# EAGLE design PCB0M3_12B (EAGLE 6.2)

## Sheet 1 of 7
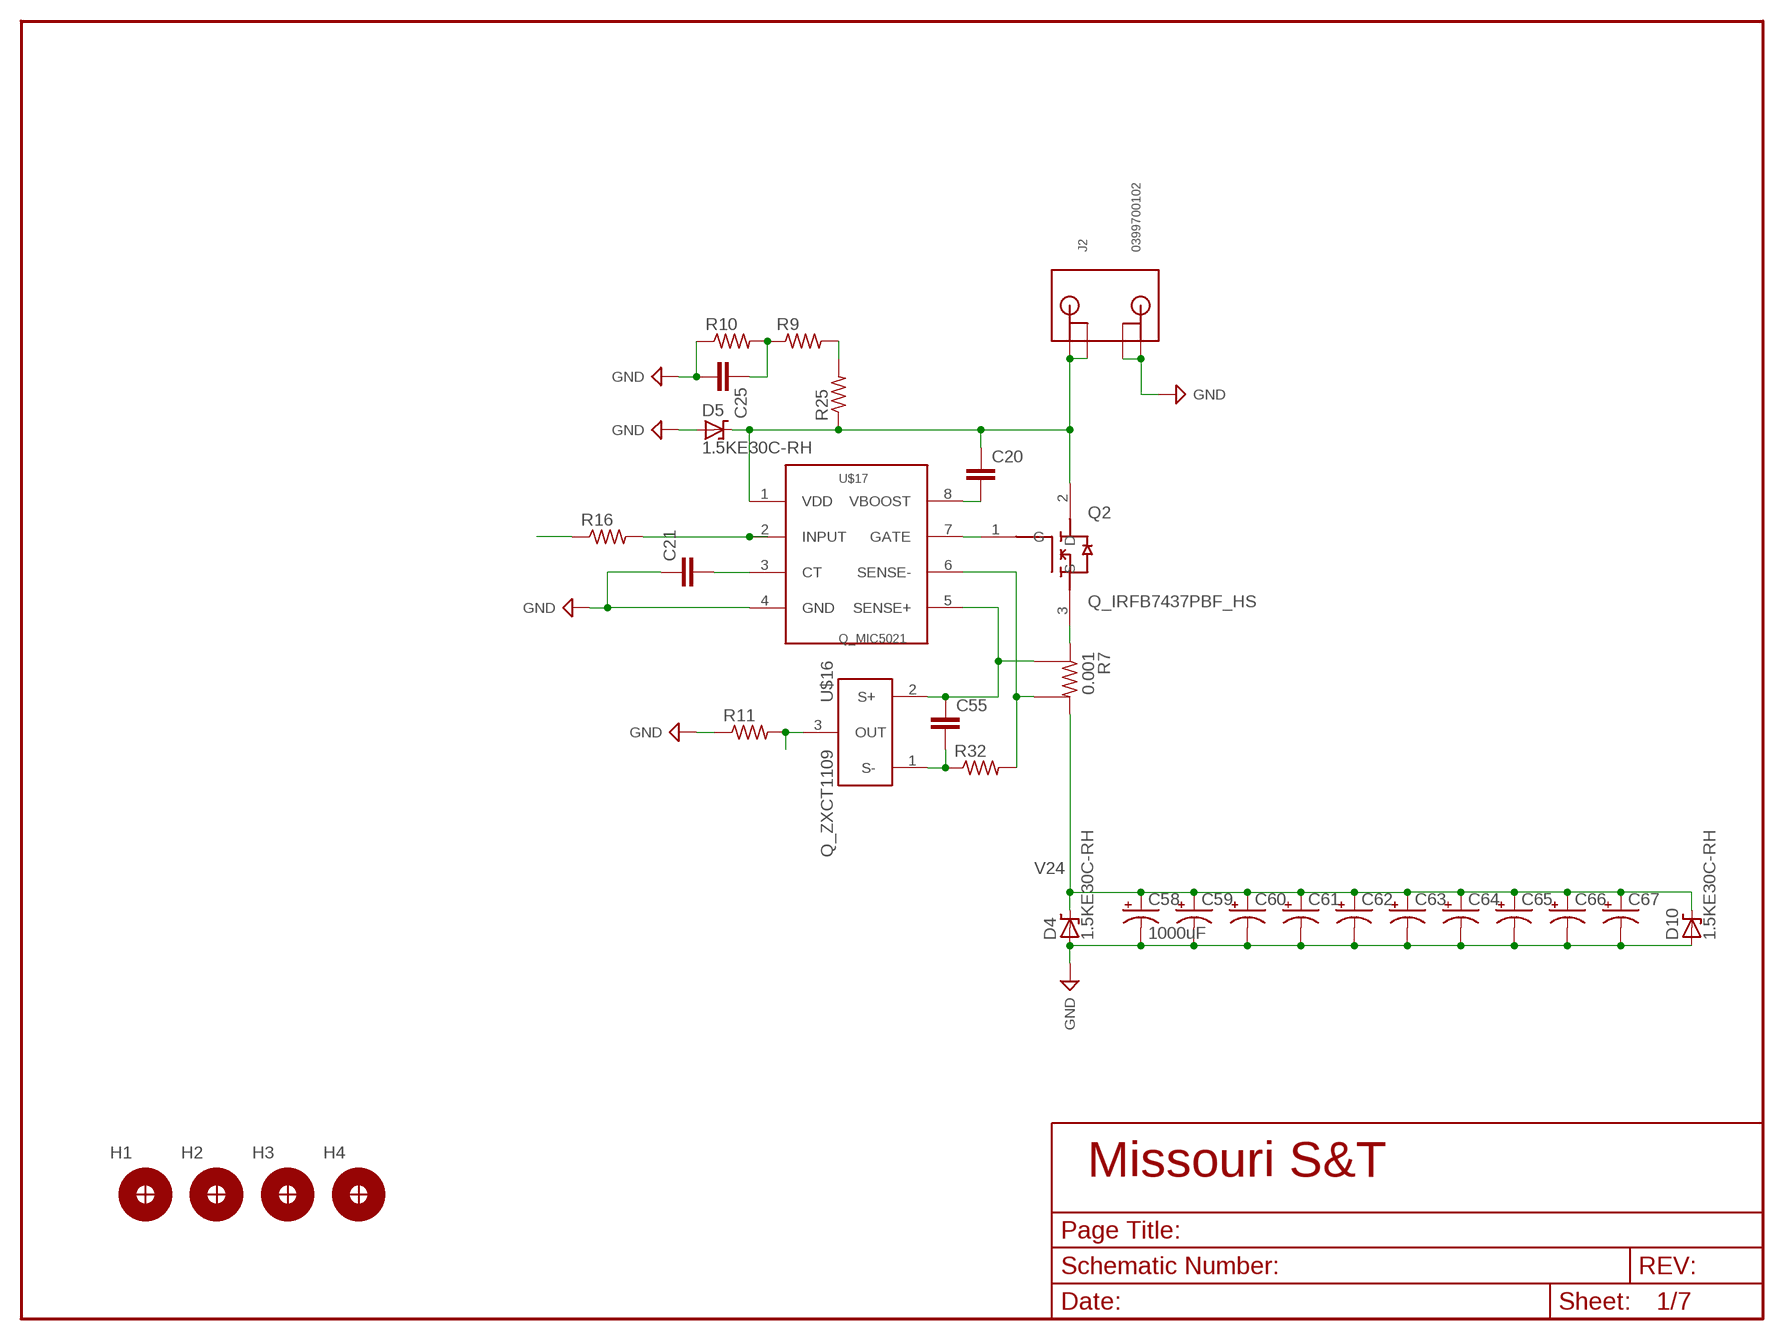
[diagram p0: schematic, sheet 1]

### Parts
C20  C_CAP_1206  [C_1206]
C21  C_CAP_1206  [C_1206]
C25  C_CAP_1206  [C_1206]
C55  C_CAP_1206  [C_1206]
C58  1000uF  C_POL10MM  [C_10MM]
C59  C_POL10MM  [C_10MM]
C60  C_POL10MM  [C_10MM]
C61  C_POL10MM  [C_10MM]
C62  C_POL10MM  [C_10MM]
C63  C_POL10MM  [C_10MM]
C64  C_POL10MM  [C_10MM]
C65  C_POL10MM  [C_10MM]
C66  C_POL10MM  [C_10MM]
C67  C_POL10MM  [C_10MM]
D4  1.5KE30C-RH  D_1.5KE480A_D3.5MM_LS15.24MM  [DIODE_D3.5MM_LS15.24MM]
D5  1.5KE30C-RH  D_1.5KE480A_D3.5MM_LS15.24MM  [DIODE_D3.5MM_LS15.24MM]
D10  1.5KE30C-RH  D_1.5KE480A_D3.5MM_LS15.24MM  [DIODE_D3.5MM_LS15.24MM]
H1  H_MNTHOLE_#8  [H_MNTHOLE_#8]
H2  H_MNTHOLE_#8  [H_MNTHOLE_#8]
H3  H_MNTHOLE_#8  [H_MNTHOLE_#8]
H4  H_MNTHOLE_#8  [H_MNTHOLE_#8]
J2  0399700102  J_0399700102  [J_2CONHC]
Q2  Q_IRFB7437PBF_HS  [TO-220-531102B02500G]
R7  0.001  R_FC4L110R001JER  [R_FC4L]
R9  R_RES_1206  [R_1206]
R10  R_RES_1206  [R_1206]
R11  R_RES_1206  [R_1206]
R16  R_RES_1206  [R_1206]
R25  R_1/4W  [R_1/4W]
R32  R_RES_1206  [R_1206]
U$16  Q_ZXCT1109  [SOT23]
U$17  Q_MIC5021  [DIP8]

### Nets
GND: C21.1 C25.2 C58.P$2(-) C59.P$2(-) C60.P$2(-) C61.P$2(-) C62.P$2(-) C63.P$2(-) C64.P$2(-) C65.P$2(-) C66.P$2(-) C67.P$2(-) D4.A D5.A D10.A J2.PIN2-1(2-1) J2.PIN2-2(2-2) R10.1 R11.1 U$17.4(GND) ; supply symbol labelled SUP_GND ; also sheet 2,3,4,5,6,7
M_IMAIN: R11.2 U$16.3(OUT) ; also sheet 7
M_VMAIN: C25.1 R9.1 R10.2 ; also sheet 7
N$44: Q2.1(G) U$17.7(GATE)
N$45: Q2.3(S) R7.1
N$46: C55.1 R7.SENSE1 U$16.2(S+) U$17.5(SENSE+)
N$47: R16.2 U$17.2(INPUT)
N$48: C21.2 U$17.3(CT)
N$51: C55.2 R32.1 U$16.1(S-)
N$85: R7.SENSE2 R32.2 U$17.6(SENSE-)
N$92: R9.2 R25.2
N$95: C20.2 U$17.8(VBOOST)
S_MAIN: R16.1 ; also sheet 7
V1: C20.1 D5.C(K) J2.PIN1-1(1-1) J2.PIN1-2(1-2) Q2.2(D) R25.1 U$17.1(VDD) ; also sheet 7
V24: C58.P$1(+) C59.P$1(+) C60.P$1(+) C61.P$1(+) C62.P$1(+) C63.P$1(+) C64.P$1(+) C65.P$1(+) C66.P$1(+) C67.P$1(+) D4.C(K) D10.C(K) R7.2 ; also sheet 2,3,5,6
Unconnected: H1.1 H2.1 H3.1 H4.1

## Sheet 2 of 7
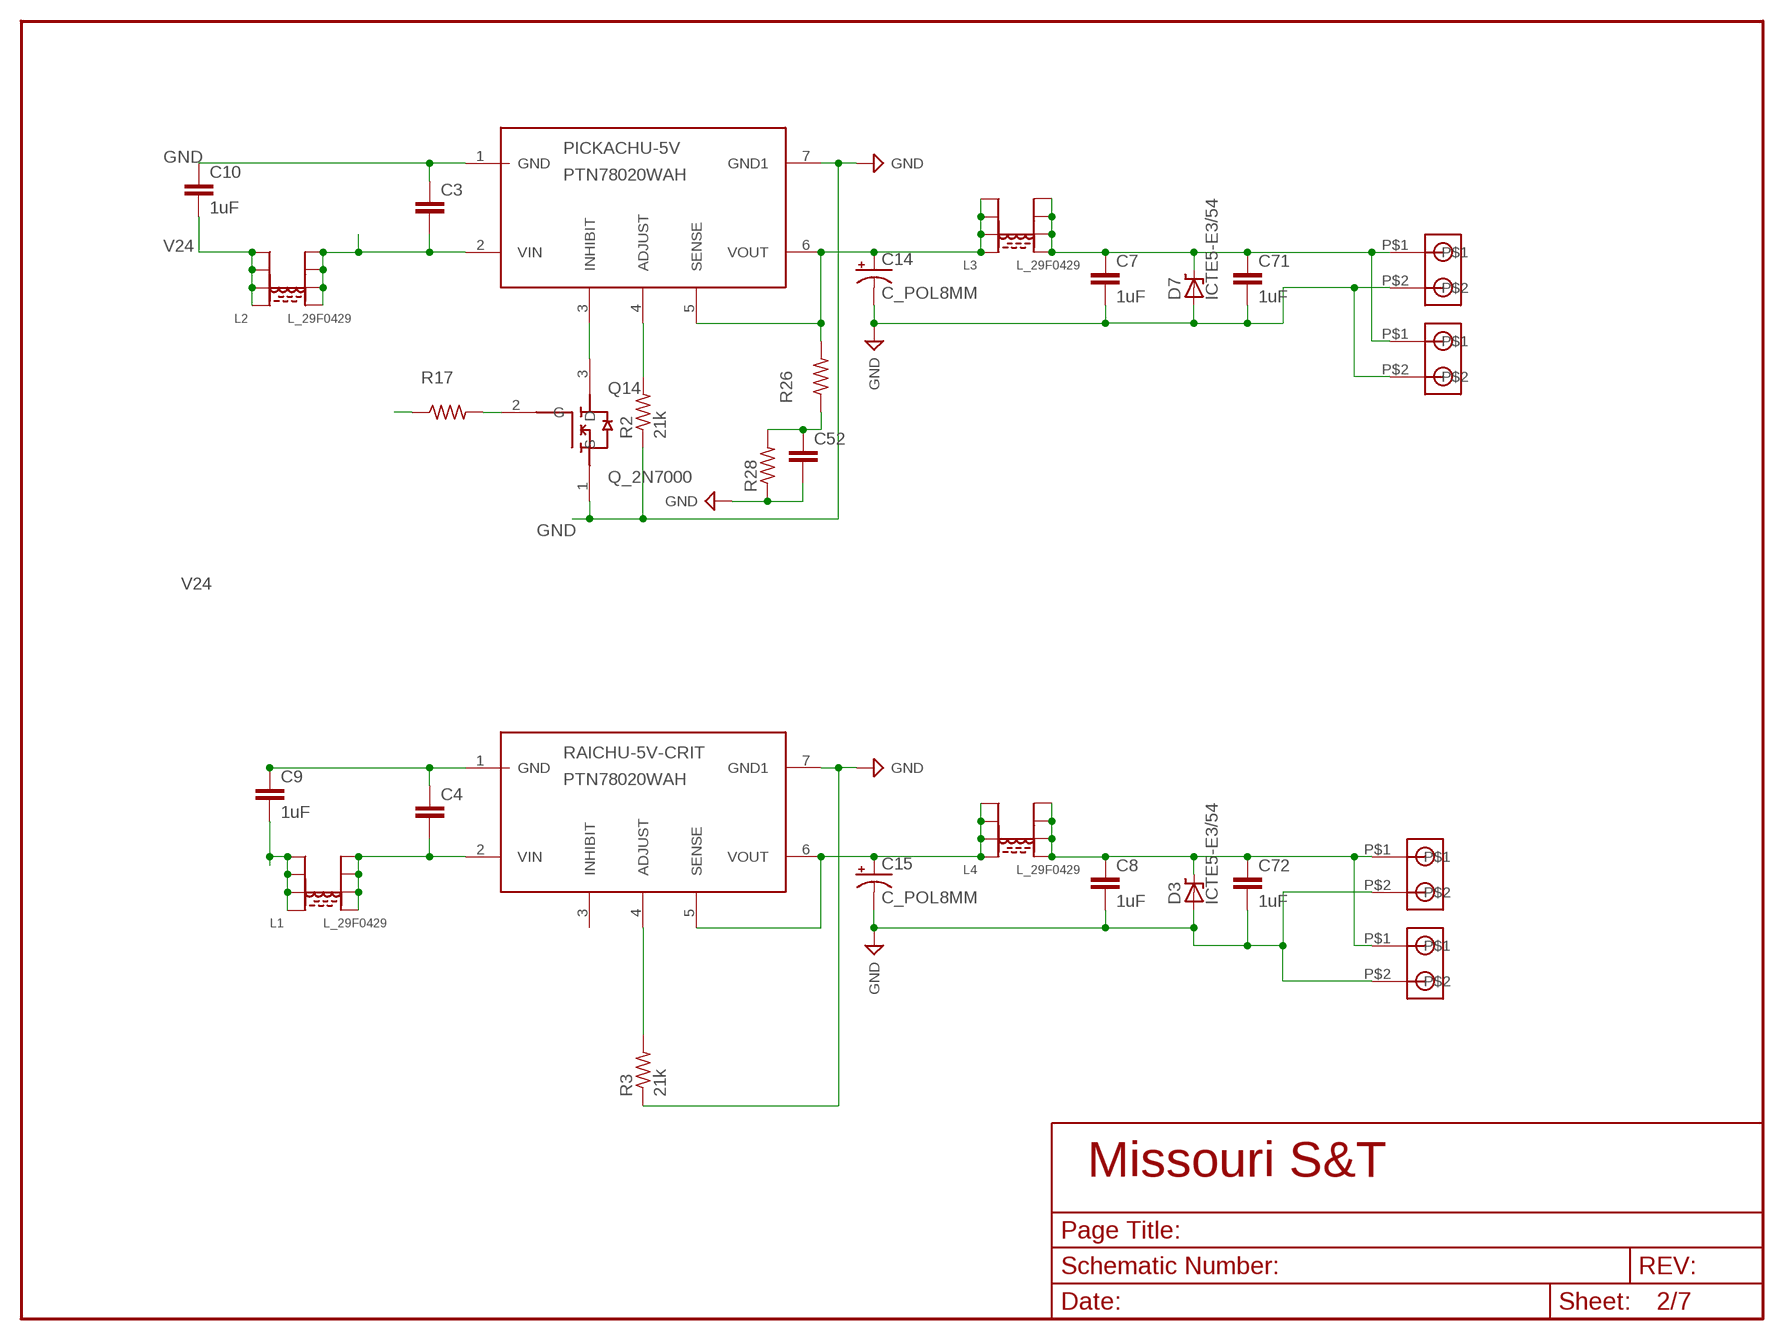
[diagram p1: schematic, sheet 2]

### Parts
C3  C_CAP_1206  [C_1206]
C4  C_CAP_1206  [C_1206]
C7  1uF  C_CAP_1206  [C_1206]
C8  1uF  C_CAP_1206  [C_1206]
C9  1uF  C_CAP_1206  [C_1206]
C10  1uF  C_CAP_1206  [C_1206]
C14  C_POL8MM  [C_8MM]
C15  C_POL8MM  [C_8MM]
C52  C_CAP_1206  [C_1206]
C71  1uF  C_CAP_1206  [C_1206]
C72  1uF  C_CAP_1206  [C_1206]
D3  ICTE5-E3/54  D_1.5KE480A_D3.5MM_LS15.24MM  [DIODE_D3.5MM_LS15.24MM]
D7  ICTE5-E3/54  D_1.5KE480A_D3.5MM_LS15.24MM  [DIODE_D3.5MM_LS15.24MM]
L1  L_29F0429  [L_29F0429]
L2  L_29F0429  [L_29F0429]
L3  L_29F0429  [L_29F0429]
L4  L_29F0429  [L_29F0429]
PICKACHU-5V  PTN78020WAH  Q_PTN78020  [R_PDSS-T7]
Q14  Q_2N7000  [TO-92-3]
R2  21k  R_1/4W  [R_1/4W]
R3  21k  R_1/4W  [R_1/4W]
R17  R_1/4WL  [R_1/4WL]
R26  R_1/4WL  [R_1/4WL]
R28  R_RES_1206  [R_1206]
RAICHU-5V-CRIT  PTN78020WAH  Q_PTN78020  [R_PDSS-T7]
U$52  J_1546074-2282834-2  [J_2.54MM]
U$53  J_1546074-2282834-2  [J_2.54MM]
U$54  J_1546074-2282834-2  [J_2.54MM]
U$55  J_1546074-2282834-2  [J_2.54MM]

### Nets
GND: C3.1 C4.1 C7.2 C8.2 C9.1 C10.1 C14.- C15.- C52.2 C71.2 C72.2 D3.A D7.A PICKACHU-5V.1(GND) PICKACHU-5V.7(GND1) Q14.1(S) R2.1 R3.1 R28.1 RAICHU-5V-CRIT.1(GND) RAICHU-5V-CRIT.7(GND1) U$52.P$2 U$53.P$2 U$54.P$2 U$55.P$2 ; supply symbol labelled SUP_GND ; also sheet 1,3,4,5,6,7
M_V5-2: C52.1 R26.1 R28.2 ; also sheet 7
N$3: Q14.2(G) R17.2
N$49: R3.2 RAICHU-5V-CRIT.4(ADJUST)
N$50: PICKACHU-5V.4(ADJUST) R2.2
N$53: C14.+ L3.1 L3.2 L3.3 L3.4 PICKACHU-5V.5(SENSE) PICKACHU-5V.6(VOUT) R26.2
N$54: C15.+ L4.1 L4.2 L4.3 L4.4 RAICHU-5V-CRIT.5(SENSE) RAICHU-5V-CRIT.6(VOUT)
N$65: C3.2 L2.5 L2.6 L2.7 L2.8 PICKACHU-5V.2(VIN)
N$103: PICKACHU-5V.3(INHIBIT) Q14.3(D)
N$112: C4.2 L1.5 L1.6 L1.7 L1.8 RAICHU-5V-CRIT.2(VIN)
S_V5-2: R17.1 ; also sheet 7
V5-CRT: C8.1 C72.1 D3.C(K) L4.5 L4.6 L4.7 L4.8 U$52.P$1 U$53.P$1
V12: C7.1 C71.1 D7.C(K) L3.5 L3.6 L3.7 L3.8 U$54.P$1 U$55.P$1
V24: C9.2 C10.2 L1.1 L1.2 L1.3 L1.4 L2.1 L2.2 L2.3 L2.4 ; also sheet 1,3,5,6
Unconnected: RAICHU-5V-CRIT.3(INHIBIT)

## Sheet 3 of 7
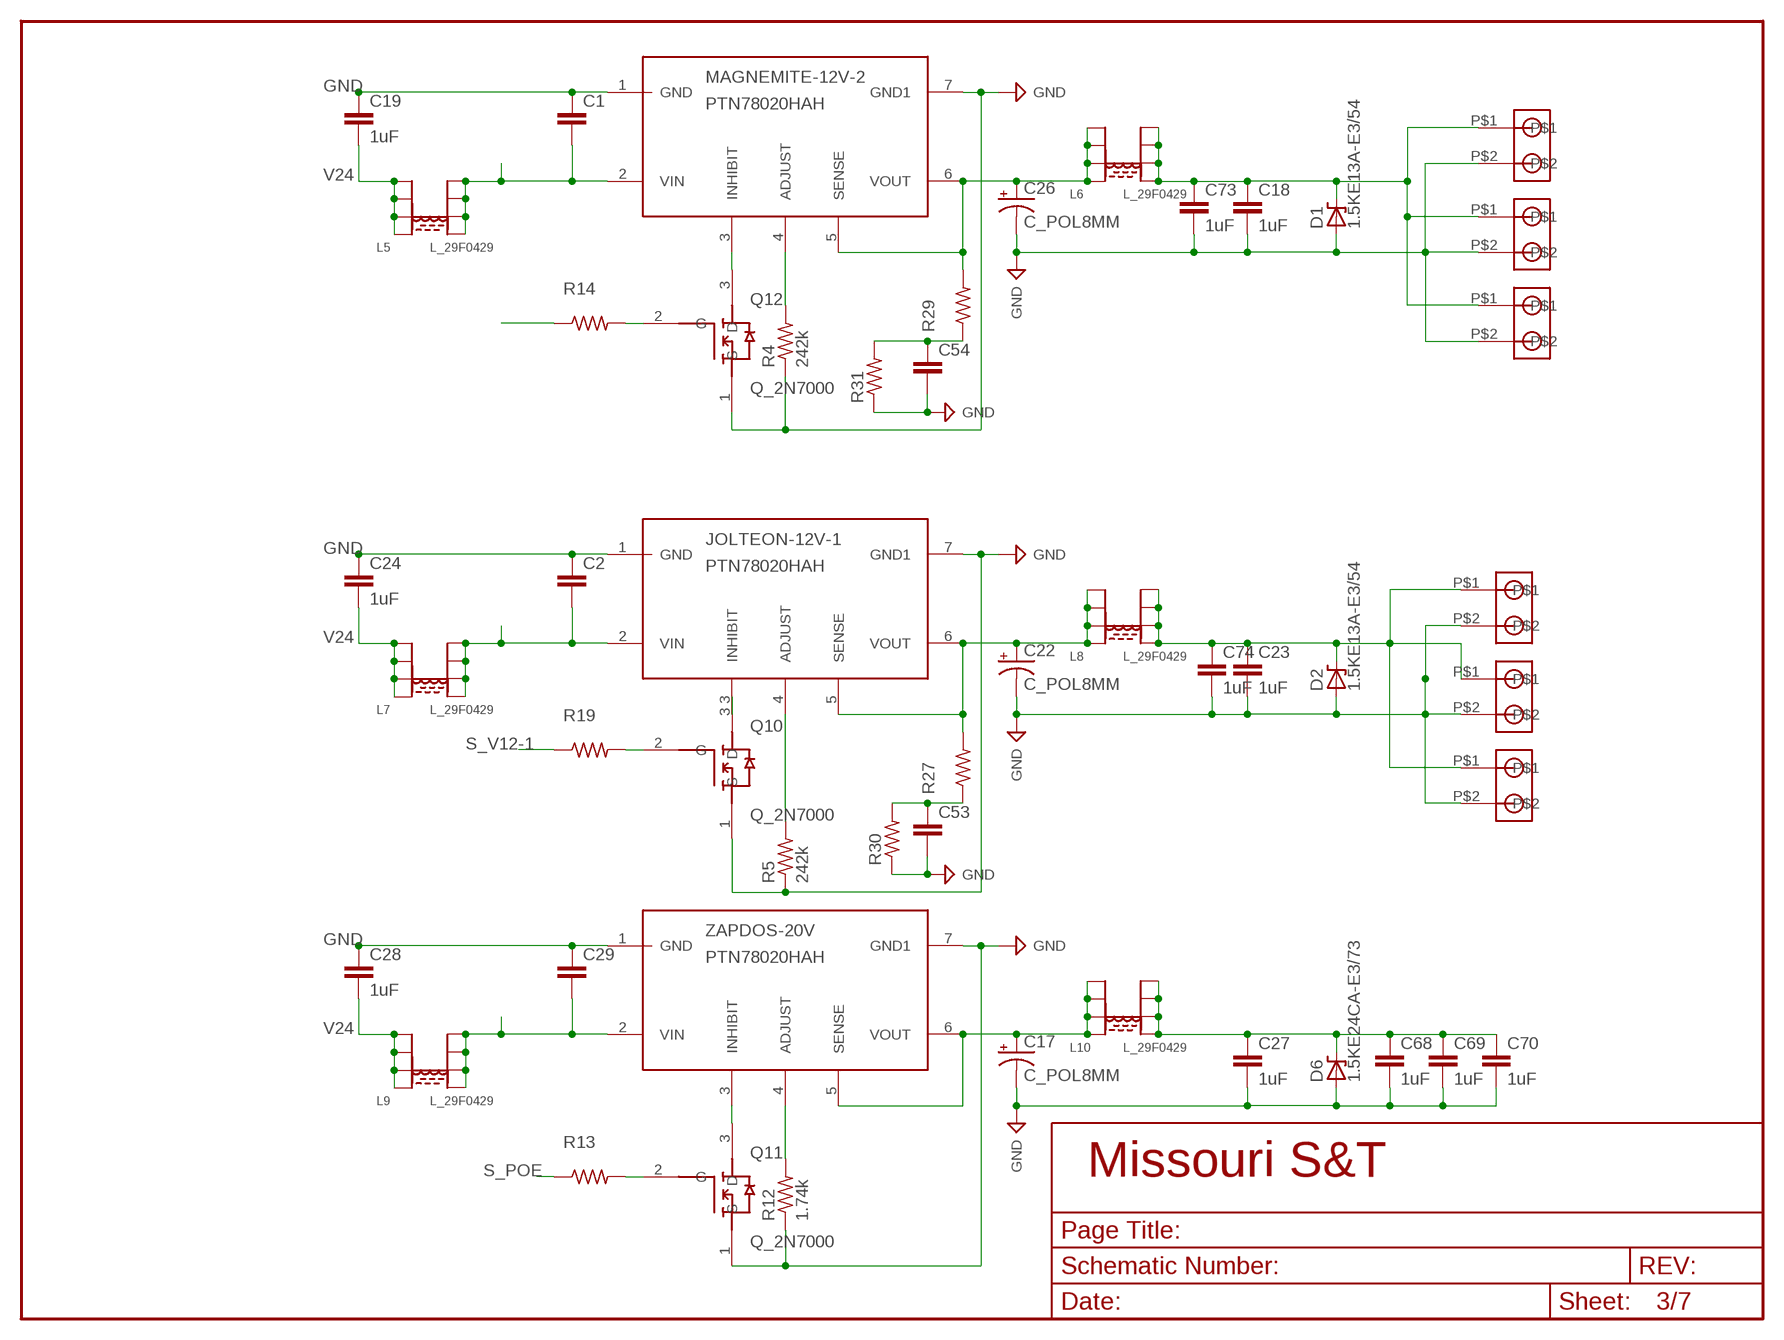
[diagram p2: schematic, sheet 3]

### Parts
C1  C_CAP_1206  [C_1206]
C2  C_CAP_1206  [C_1206]
C17  C_POL8MM  [C_8MM]
C18  1uF  C_CAP_1206  [C_1206]
C19  1uF  C_CAP_1206  [C_1206]
C22  C_POL8MM  [C_8MM]
C23  1uF  C_CAP_1206  [C_1206]
C24  1uF  C_CAP_1206  [C_1206]
C26  C_POL8MM  [C_8MM]
C27  1uF  C_CAP_1206  [C_1206]
C28  1uF  C_CAP_1206  [C_1206]
C29  C_CAP_1206  [C_1206]
C53  C_CAP_1206  [C_1206]
C54  C_CAP_1206  [C_1206]
C68  1uF  C_CAP_1206  [C_1206]
C69  1uF  C_CAP_1206  [C_1206]
C70  1uF  C_CAP_1206  [C_1206]
C73  1uF  C_CAP_1206  [C_1206]
C74  1uF  C_CAP_1206  [C_1206]
D1  1.5KE13A-E3/54  D_1.5KE480A_D3.5MM_LS15.24MM  [DIODE_D3.5MM_LS15.24MM]
D2  1.5KE13A-E3/54  D_1.5KE480A_D3.5MM_LS15.24MM  [DIODE_D3.5MM_LS15.24MM]
D6  1.5KE24CA-E3/73  D_1.5KE480A_D3.5MM_LS15.24MM  [DIODE_D3.5MM_LS15.24MM]
J3  J_1546074-2282834-2  [J_2.54MM]
J4  J_1546074-2282834-2  [J_2.54MM]
J5  J_1546074-2282834-2  [J_2.54MM]
J6  J_1546074-2282834-2  [J_2.54MM]
J7  J_1546074-2282834-2  [J_2.54MM]
J8  J_1546074-2282834-2  [J_2.54MM]
JOLTEON-12V-1  PTN78020HAH  Q_PTN78020  [R_PDSS-T7]
L5  L_29F0429  [L_29F0429]
L6  L_29F0429  [L_29F0429]
L7  L_29F0429  [L_29F0429]
L8  L_29F0429  [L_29F0429]
L9  L_29F0429  [L_29F0429]
L10  L_29F0429  [L_29F0429]
MAGNEMITE-12V-2  PTN78020HAH  Q_PTN78020  [R_PDSS-T7]
Q10  Q_2N7000  [TO-92-3]
Q11  Q_2N7000  [TO-92-3]
Q12  Q_2N7000  [TO-92-3]
R4  242k  R_1/4W  [R_1/4W]
R5  242k  R_1/4W  [R_1/4W]
R12  1.74k  R_1/4W  [R_1/4W]
R13  R_1/4WL  [R_1/4WL]
R14  R_1/4WL  [R_1/4WL]
R19  R_1/4WL  [R_1/4WL]
R27  R_1/4WL  [R_1/4WL]
R29  R_1/4WL  [R_1/4WL]
R30  R_RES_1206  [R_1206]
R31  R_RES_1206  [R_1206]
ZAPDOS-20V  PTN78020HAH  Q_PTN78020  [R_PDSS-T7]

### Nets
GND: C1.1 C2.1 C17.- C18.2 C19.1 C22.- C23.2 C24.1 C26.- C27.2 C28.1 C29.1 C53.2 C54.2 C68.2 C69.2 C70.2 C73.2 C74.2 D1.A D2.A D6.A J3.P$2 J4.P$2 J5.P$2 J6.P$2 J7.P$2 J8.P$2 JOLTEON-12V-1.1(GND) JOLTEON-12V-1.7(GND1) MAGNEMITE-12V-2.1(GND) MAGNEMITE-12V-2.7(GND1) Q10.1(S) Q11.1(S) Q12.1(S) R4.1 R5.1 R12.1 R30.1 R31.1 ZAPDOS-20V.1(GND) ZAPDOS-20V.7(GND1) ; supply symbol labelled SUP_GND ; also sheet 1,2,4,5,6,7
M_V12-1: C53.1 R27.1 R30.2 ; also sheet 7
M_V12-2: C54.1 R29.1 R31.2 ; also sheet 7
N$1: MAGNEMITE-12V-2.4(ADJUST) R4.2
N$2: C26.+ L6.1 L6.2 L6.3 L6.4 MAGNEMITE-12V-2.5(SENSE) MAGNEMITE-12V-2.6(VOUT) R29.2
N$4: JOLTEON-12V-1.4(ADJUST) R5.2
N$5: C22.+ JOLTEON-12V-1.5(SENSE) JOLTEON-12V-1.6(VOUT) L8.1 L8.2 L8.3 L8.4 R27.2
N$57: C1.2 L5.5 L5.6 L5.7 L5.8 MAGNEMITE-12V-2.2(VIN)
N$88: R12.2 ZAPDOS-20V.4(ADJUST)
N$97: C17.+ L10.1 L10.2 L10.3 L10.4 ZAPDOS-20V.5(SENSE) ZAPDOS-20V.6(VOUT)
N$98: C29.2 L9.5 L9.6 L9.7 L9.8 ZAPDOS-20V.2(VIN)
N$99: JOLTEON-12V-1.3(INHIBIT) Q10.3(D)
N$100: MAGNEMITE-12V-2.3(INHIBIT) Q12.3(D)
N$101: Q11.3(D) ZAPDOS-20V.3(INHIBIT)
N$110: C2.2 JOLTEON-12V-1.2(VIN) L7.5 L7.6 L7.7 L7.8
N$111: Q11.2(G) R13.2
N$113: Q10.2(G) R19.2
N$114: Q12.2(G) R14.2
S_12V-2: R14.1 ; also sheet 7
S_POE: R13.1 ; also sheet 7
S_V12-1: R19.1 ; also sheet 7
V15_1: C18.1 C73.1 D1.C(K) J6.P$1 J7.P$1 J8.P$1 L6.5 L6.6 L6.7 L6.8
V15_2: C23.1 C74.1 D2.C(K) J3.P$1 J4.P$1 J5.P$1 L8.5 L8.6 L8.7 L8.8
V24: C19.2 C24.2 C28.2 L5.1 L5.2 L5.3 L5.4 L7.1 L7.2 L7.3 L7.4 L9.1 L9.2 L9.3 L9.4 ; also sheet 1,2,5,6
V_POE: C27.1 C68.1 C69.1 C70.1 D6.C(K) L10.5 L10.6 L10.7 L10.8 ; also sheet 4

## Sheet 4 of 7
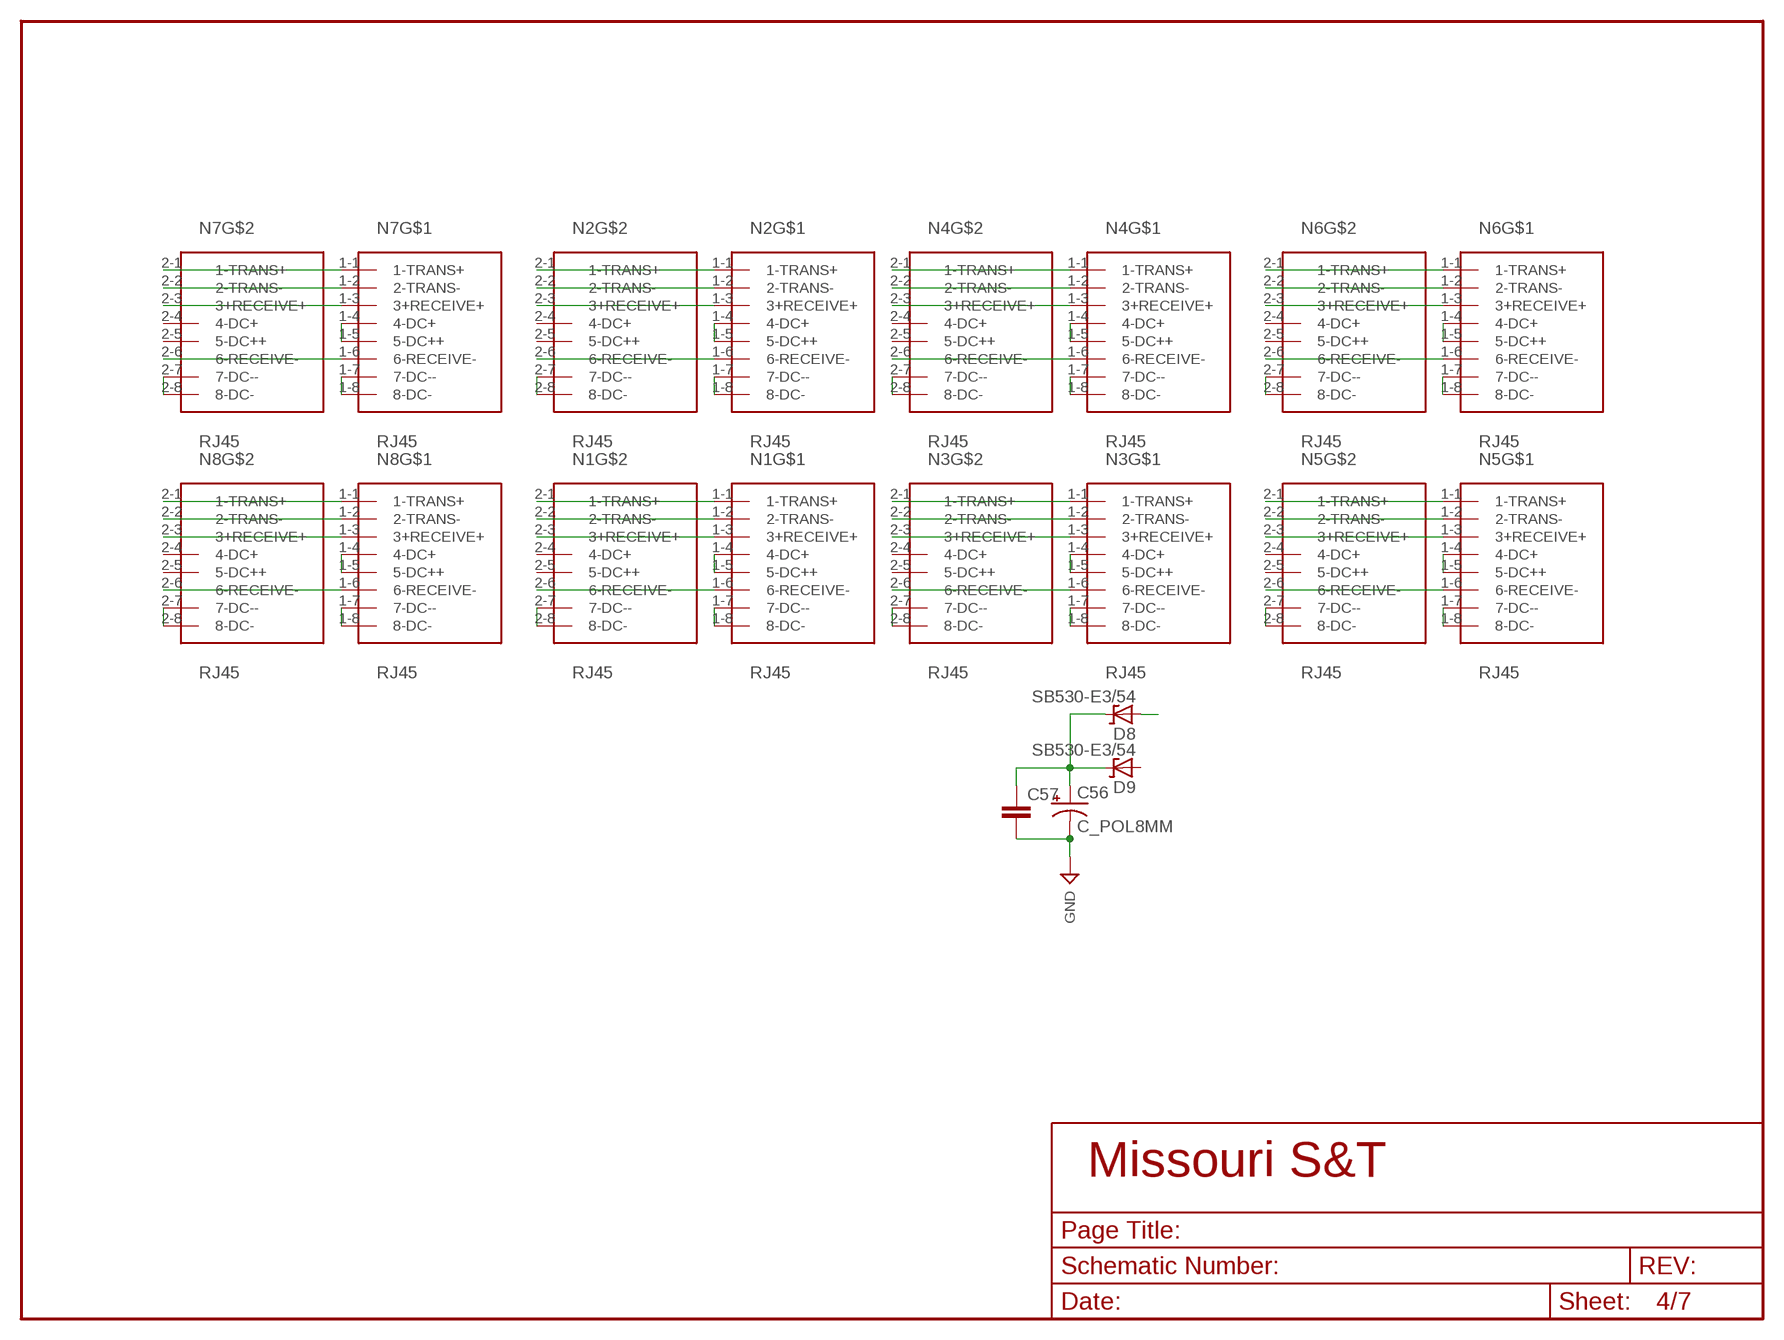
[diagram p3: schematic, sheet 4]

### Parts
C56  C_POL8MM  [C_8MM]
C57  C_CAP_1206  [C_1206]
D8  SB530-E3/54  D_1.5KE480A_D3.5MM_LS15.24MM  [DIODE_D3.5MM_LS15.24MM]
D9  SB530-E3/54  D_1.5KE480A_D3.5MM_LS15.24MM  [DIODE_D3.5MM_LS15.24MM]
N1  RJ45  RJ45-2PORT  [RJ45-CAT5E-2PACK]
N2  RJ45  RJ45-2PORT  [RJ45-CAT5E-2PACK]
N3  RJ45  RJ45-2PORT  [RJ45-CAT5E-2PACK]
N4  RJ45  RJ45-2PORT  [RJ45-CAT5E-2PACK]
N5  RJ45  RJ45-2PORT  [RJ45-CAT5E-2PACK]
N6  RJ45  RJ45-2PORT  [RJ45-CAT5E-2PACK]
N7  RJ45  RJ45-2PORT  [RJ45-CAT5E-2PACK]
N8  RJ45  RJ45-2PORT  [RJ45-CAT5E-2PACK]

### Nets
GND: C56.- C57.2 N1.1-7(7-DC--) N1.1-8(8-DC-) N1.2-7(7-DC--) N1.2-8(8-DC-) N2.1-7(7-DC--) N2.1-8(8-DC-) N2.2-7(7-DC--) N2.2-8(8-DC-) N3.1-7(7-DC--) N3.1-8(8-DC-) N3.2-7(7-DC--) N3.2-8(8-DC-) N4.1-7(7-DC--) N4.1-8(8-DC-) N4.2-7(7-DC--) N4.2-8(8-DC-) N5.1-7(7-DC--) N5.1-8(8-DC-) N5.2-7(7-DC--) N5.2-8(8-DC-) N6.1-7(7-DC--) N6.1-8(8-DC-) N6.2-7(7-DC--) N6.2-8(8-DC-) N7.1-7(7-DC--) N7.1-8(8-DC-) N7.2-7(7-DC--) N7.2-8(8-DC-) N8.1-7(7-DC--) N8.1-8(8-DC-) N8.2-7(7-DC--) N8.2-8(8-DC-) ; supply symbol labelled SUP_GND ; also sheet 1,2,3,5,6,7
N$7: N6.1-1(1-TRANS+) N6.2-1(1-TRANS+)
N$8: N6.1-2(2-TRANS-) N6.2-2(2-TRANS-)
N$9: N6.1-3(3+RECEIVE+) N6.2-3(3+RECEIVE+)
N$10: N6.1-6(6-RECEIVE-) N6.2-6(6-RECEIVE-)
N$11: N5.1-1(1-TRANS+) N5.2-1(1-TRANS+)
N$12: N5.1-2(2-TRANS-) N5.2-2(2-TRANS-)
N$13: N5.1-3(3+RECEIVE+) N5.2-3(3+RECEIVE+)
N$14: N5.1-6(6-RECEIVE-) N5.2-6(6-RECEIVE-)
N$15: N4.1-1(1-TRANS+) N4.2-1(1-TRANS+)
N$16: N4.1-2(2-TRANS-) N4.2-2(2-TRANS-)
N$17: N4.1-3(3+RECEIVE+) N4.2-3(3+RECEIVE+)
N$18: N4.1-6(6-RECEIVE-) N4.2-6(6-RECEIVE-)
N$19: N3.1-1(1-TRANS+) N3.2-1(1-TRANS+)
N$20: N3.1-2(2-TRANS-) N3.2-2(2-TRANS-)
N$21: N3.1-6(6-RECEIVE-) N3.2-6(6-RECEIVE-)
N$22: N2.1-1(1-TRANS+) N2.2-1(1-TRANS+)
N$23: N2.1-2(2-TRANS-) N2.2-2(2-TRANS-)
N$24: N2.1-3(3+RECEIVE+) N2.2-3(3+RECEIVE+)
N$25: N2.1-6(6-RECEIVE-) N2.2-6(6-RECEIVE-)
N$26: N1.1-1(1-TRANS+) N1.2-1(1-TRANS+)
N$27: N1.1-2(2-TRANS-) N1.2-2(2-TRANS-)
N$28: N1.1-3(3+RECEIVE+) N1.2-3(3+RECEIVE+)
N$29: N1.1-6(6-RECEIVE-) N1.2-6(6-RECEIVE-)
N$30: N3.1-3(3+RECEIVE+) N3.2-3(3+RECEIVE+)
N$31: N7.1-1(1-TRANS+) N7.2-1(1-TRANS+)
N$32: N7.1-2(2-TRANS-) N7.2-2(2-TRANS-)
N$33: N7.1-3(3+RECEIVE+) N7.2-3(3+RECEIVE+)
N$34: N7.1-6(6-RECEIVE-) N7.2-6(6-RECEIVE-)
N$35: N8.1-1(1-TRANS+) N8.2-1(1-TRANS+)
N$36: N8.1-2(2-TRANS-) N8.2-2(2-TRANS-)
N$37: N8.1-3(3+RECEIVE+) N8.2-3(3+RECEIVE+)
N$38: N8.1-6(6-RECEIVE-) N8.2-6(6-RECEIVE-)
V_ANTENNA: C56.+ C57.1 D8.C(K) D9.C(K) N1.1-4(4-DC+) N1.1-5(5-DC++)
V_POE: D8.A N2.1-4(4-DC+) N2.1-5(5-DC++) N3.1-4(4-DC+) N3.1-5(5-DC++) N4.1-4(4-DC+) N4.1-5(5-DC++) N5.1-4(4-DC+) N5.1-5(5-DC++) N6.1-4(4-DC+) N6.1-5(5-DC++) N7.1-4(4-DC+) N7.1-5(5-DC++) N8.1-4(4-DC+) N8.1-5(5-DC++) ; also sheet 3
Unconnected: D9.A N1.2-4(4-DC+) N1.2-5(5-DC++) N2.2-4(4-DC+) N2.2-5(5-DC++) N3.2-4(4-DC+) N3.2-5(5-DC++) N4.2-4(4-DC+) N4.2-5(5-DC++) N5.2-4(4-DC+) N5.2-5(5-DC++) N6.2-4(4-DC+) N6.2-5(5-DC++) N7.2-4(4-DC+) N7.2-5(5-DC++) N8.2-4(4-DC+) N8.2-5(5-DC++)

## Sheet 5 of 7
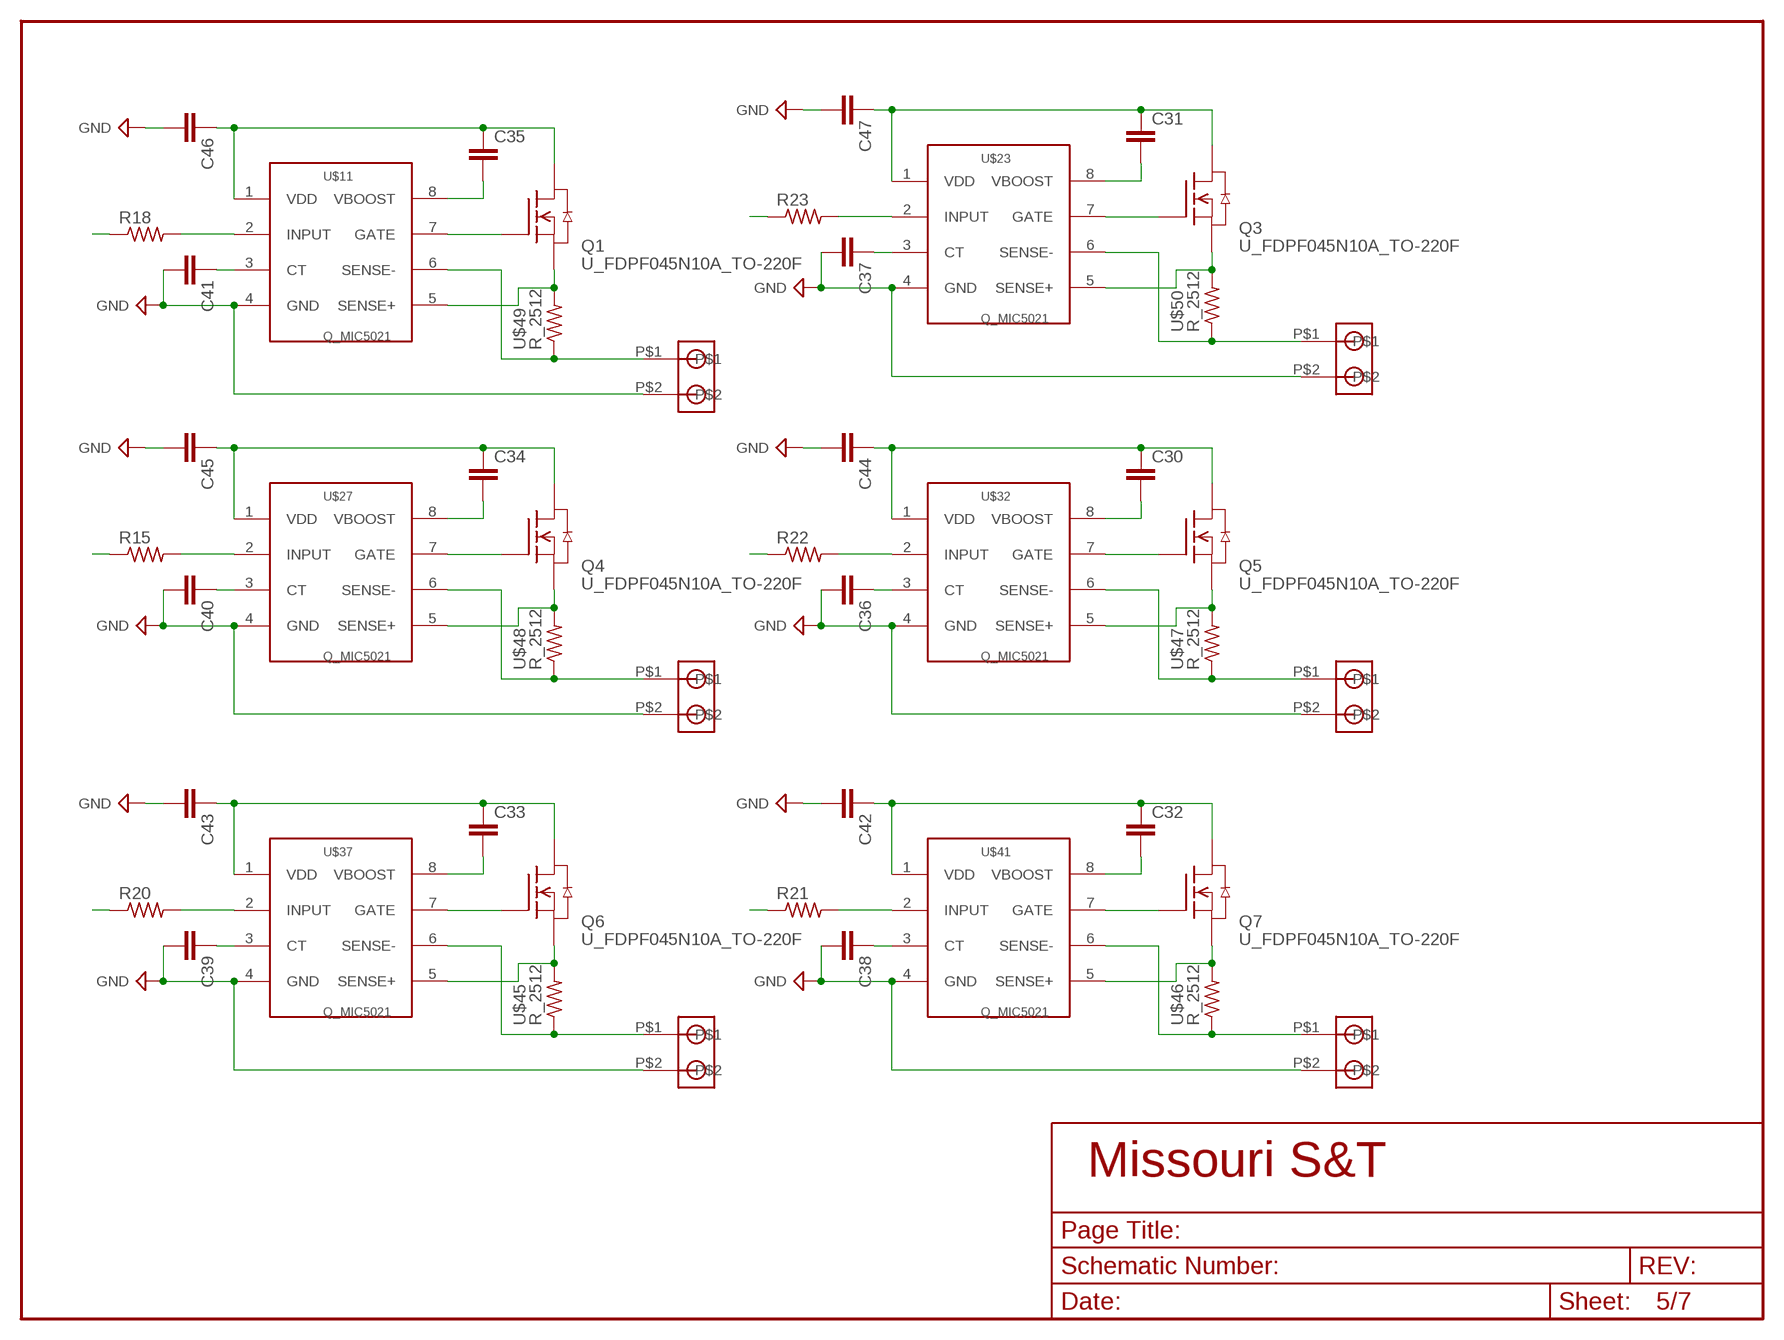
[diagram p4: schematic, sheet 5]

### Parts
C30  C_CAP_1206  [C_1206]
C31  C_CAP_1206  [C_1206]
C32  C_CAP_1206  [C_1206]
C33  C_CAP_1206  [C_1206]
C34  C_CAP_1206  [C_1206]
C35  C_CAP_1206  [C_1206]
C36  C_CAP_1206  [C_1206]
C37  C_CAP_1206  [C_1206]
C38  C_CAP_1206  [C_1206]
C39  C_CAP_1206  [C_1206]
C40  C_CAP_1206  [C_1206]
C41  C_CAP_1206  [C_1206]
C42  C_CAP_1206  [C_1206]
C43  C_CAP_1206  [C_1206]
C44  C_CAP_1206  [C_1206]
C45  C_CAP_1206  [C_1206]
C46  C_CAP_1206  [C_1206]
C47  C_CAP_1206  [C_1206]
Q1  U_FDPF045N10A_TO-220F  [TO220F]
Q3  U_FDPF045N10A_TO-220F  [TO220F]
Q4  U_FDPF045N10A_TO-220F  [TO220F]
Q5  U_FDPF045N10A_TO-220F  [TO220F]
Q6  U_FDPF045N10A_TO-220F  [TO220F]
Q7  U_FDPF045N10A_TO-220F  [TO220F]
R15  R_RES_1206  [R_1206]
R18  R_RES_1206  [R_1206]
R20  R_RES_1206  [R_1206]
R21  R_RES_1206  [R_1206]
R22  R_RES_1206  [R_1206]
R23  R_RES_1206  [R_1206]
U$11  Q_MIC5021  [DIP8]
U$14  J_1546074-2  [THERM_BLOCK_2]
U$23  Q_MIC5021  [DIP8]
U$26  J_1546074-2  [THERM_BLOCK_2]
U$27  Q_MIC5021  [DIP8]
U$31  J_1546074-2  [THERM_BLOCK_2]
U$32  Q_MIC5021  [DIP8]
U$36  J_1546074-2  [THERM_BLOCK_2]
U$37  Q_MIC5021  [DIP8]
U$40  J_1546074-2  [THERM_BLOCK_2]
U$41  Q_MIC5021  [DIP8]
U$44  J_1546074-2  [THERM_BLOCK_2]
U$45  R_2512  [R_2512]
U$46  R_2512  [R_2512]
U$47  R_2512  [R_2512]
U$48  R_2512  [R_2512]
U$49  R_2512  [R_2512]
U$50  R_2512  [R_2512]

### Nets
GND: C36.2 C37.2 C38.2 C39.2 C40.2 C41.2 C42.2 C43.2 C44.2 C45.2 C46.2 C47.2 U$11.4(GND) U$14.P$2 U$23.4(GND) U$26.P$2 U$27.4(GND) U$31.P$2 U$32.4(GND) U$36.P$2 U$37.4(GND) U$40.P$2 U$41.4(GND) U$44.P$2 ; supply symbol labelled SUP_GND ; also sheet 1,2,3,4,6,7
N$39: Q1.3(S) U$11.5(SENSE+) U$49.P$2
N$40: U$11.6(SENSE-) U$14.P$1 U$49.P$1
N$41: Q1.1(G) U$11.7(GATE)
N$42: R18.2 U$11.2(INPUT)
N$43: C35.2 U$11.8(VBOOST)
N$52: Q3.3(S) U$23.5(SENSE+) U$50.P$2
N$55: U$23.6(SENSE-) U$26.P$1 U$50.P$1
N$56: Q3.1(G) U$23.7(GATE)
N$58: R23.2 U$23.2(INPUT)
N$59: C31.2 U$23.8(VBOOST)
N$60: Q4.3(S) U$27.5(SENSE+) U$48.P$2
N$61: U$27.6(SENSE-) U$31.P$1 U$48.P$1
N$62: Q4.1(G) U$27.7(GATE)
N$63: R15.2 U$27.2(INPUT)
N$64: C34.2 U$27.8(VBOOST)
N$66: Q5.3(S) U$32.5(SENSE+) U$47.P$2
N$67: U$32.6(SENSE-) U$36.P$1 U$47.P$1
N$68: Q5.1(G) U$32.7(GATE)
N$69: R22.2 U$32.2(INPUT)
N$70: C30.2 U$32.8(VBOOST)
N$71: Q6.3(S) U$37.5(SENSE+) U$45.P$2
N$72: U$37.6(SENSE-) U$40.P$1 U$45.P$1
N$73: Q6.1(G) U$37.7(GATE)
N$74: R20.2 U$37.2(INPUT)
N$75: C33.2 U$37.8(VBOOST)
N$76: Q7.3(S) U$41.5(SENSE+) U$46.P$2
N$77: U$41.6(SENSE-) U$44.P$1 U$46.P$1
N$78: Q7.1(G) U$41.7(GATE)
N$79: R21.2 U$41.2(INPUT)
N$80: C32.2 U$41.8(VBOOST)
N$104: C41.1 U$11.3(CT)
N$105: C37.1 U$23.3(CT)
N$106: C36.1 U$32.3(CT)
N$107: C38.1 U$41.3(CT)
N$108: C39.1 U$37.3(CT)
N$109: C40.1 U$27.3(CT)
S_MC1: R22.1 ; also sheet 7
S_MC2: R21.1 ; also sheet 7
S_MC3: R20.1 ; also sheet 7
S_MC4: R18.1 ; also sheet 7
S_MC5: R15.1 ; also sheet 7
S_MC6: R23.1 ; also sheet 7
V24: C30.1 C31.1 C32.1 C33.1 C34.1 C35.1 C42.1 C43.1 C44.1 C45.1 C46.1 C47.1 Q1.2(D) Q3.2(D) Q4.2(D) Q5.2(D) Q6.2(D) Q7.2(D) U$11.1(VDD) U$23.1(VDD) U$27.1(VDD) U$32.1(VDD) U$37.1(VDD) U$41.1(VDD) ; also sheet 1,2,3,6

## Sheet 6 of 7
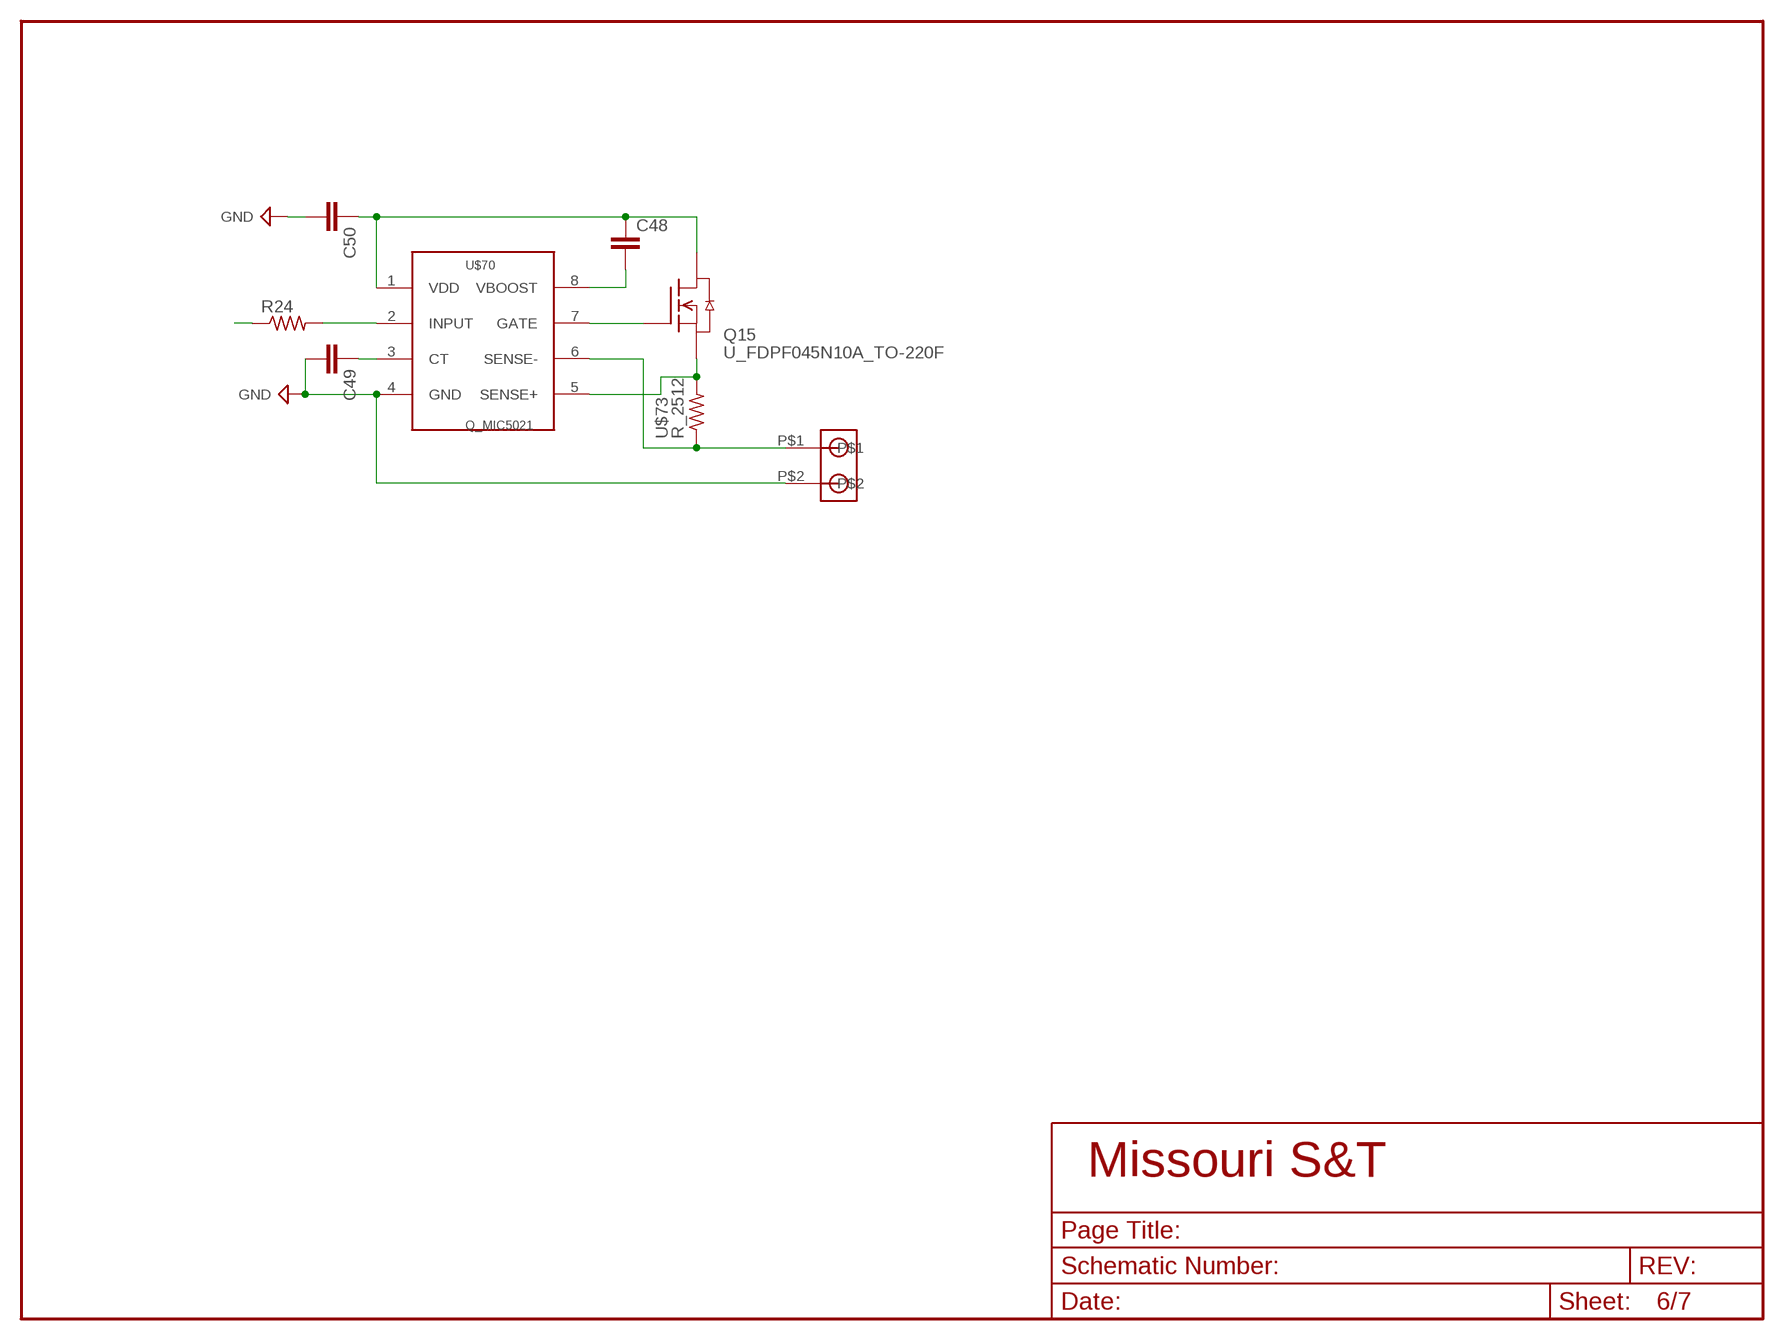
[diagram p5: schematic, sheet 6]

### Parts
C48  C_CAP_1206  [C_1206]
C49  C_CAP_1206  [C_1206]
C50  C_CAP_1206  [C_1206]
Q15  U_FDPF045N10A_TO-220F  [TO220F]
R24  R_RES_1206  [R_1206]
U$70  Q_MIC5021  [DIP8]
U$72  J_1546074-2  [THERM_BLOCK_2]
U$73  R_2512  [R_2512]

### Nets
GND: C49.2 C50.2 U$70.4(GND) U$72.P$2 ; supply symbol labelled SUP_GND ; also sheet 1,2,3,4,5,7
N$81: Q15.3(S) U$70.5(SENSE+) U$73.P$2
N$94: U$70.6(SENSE-) U$72.P$1 U$73.P$1
N$115: Q15.1(G) U$70.7(GATE)
N$116: C48.2 U$70.8(VBOOST)
N$117: C49.1 U$70.3(CT)
N$118: R24.2 U$70.2(INPUT)
S_V24AUX: R24.1 ; also sheet 7
V24: C48.1 C50.1 Q15.2(D) U$70.1(VDD) ; also sheet 1,2,3,5

## Sheet 7 of 7
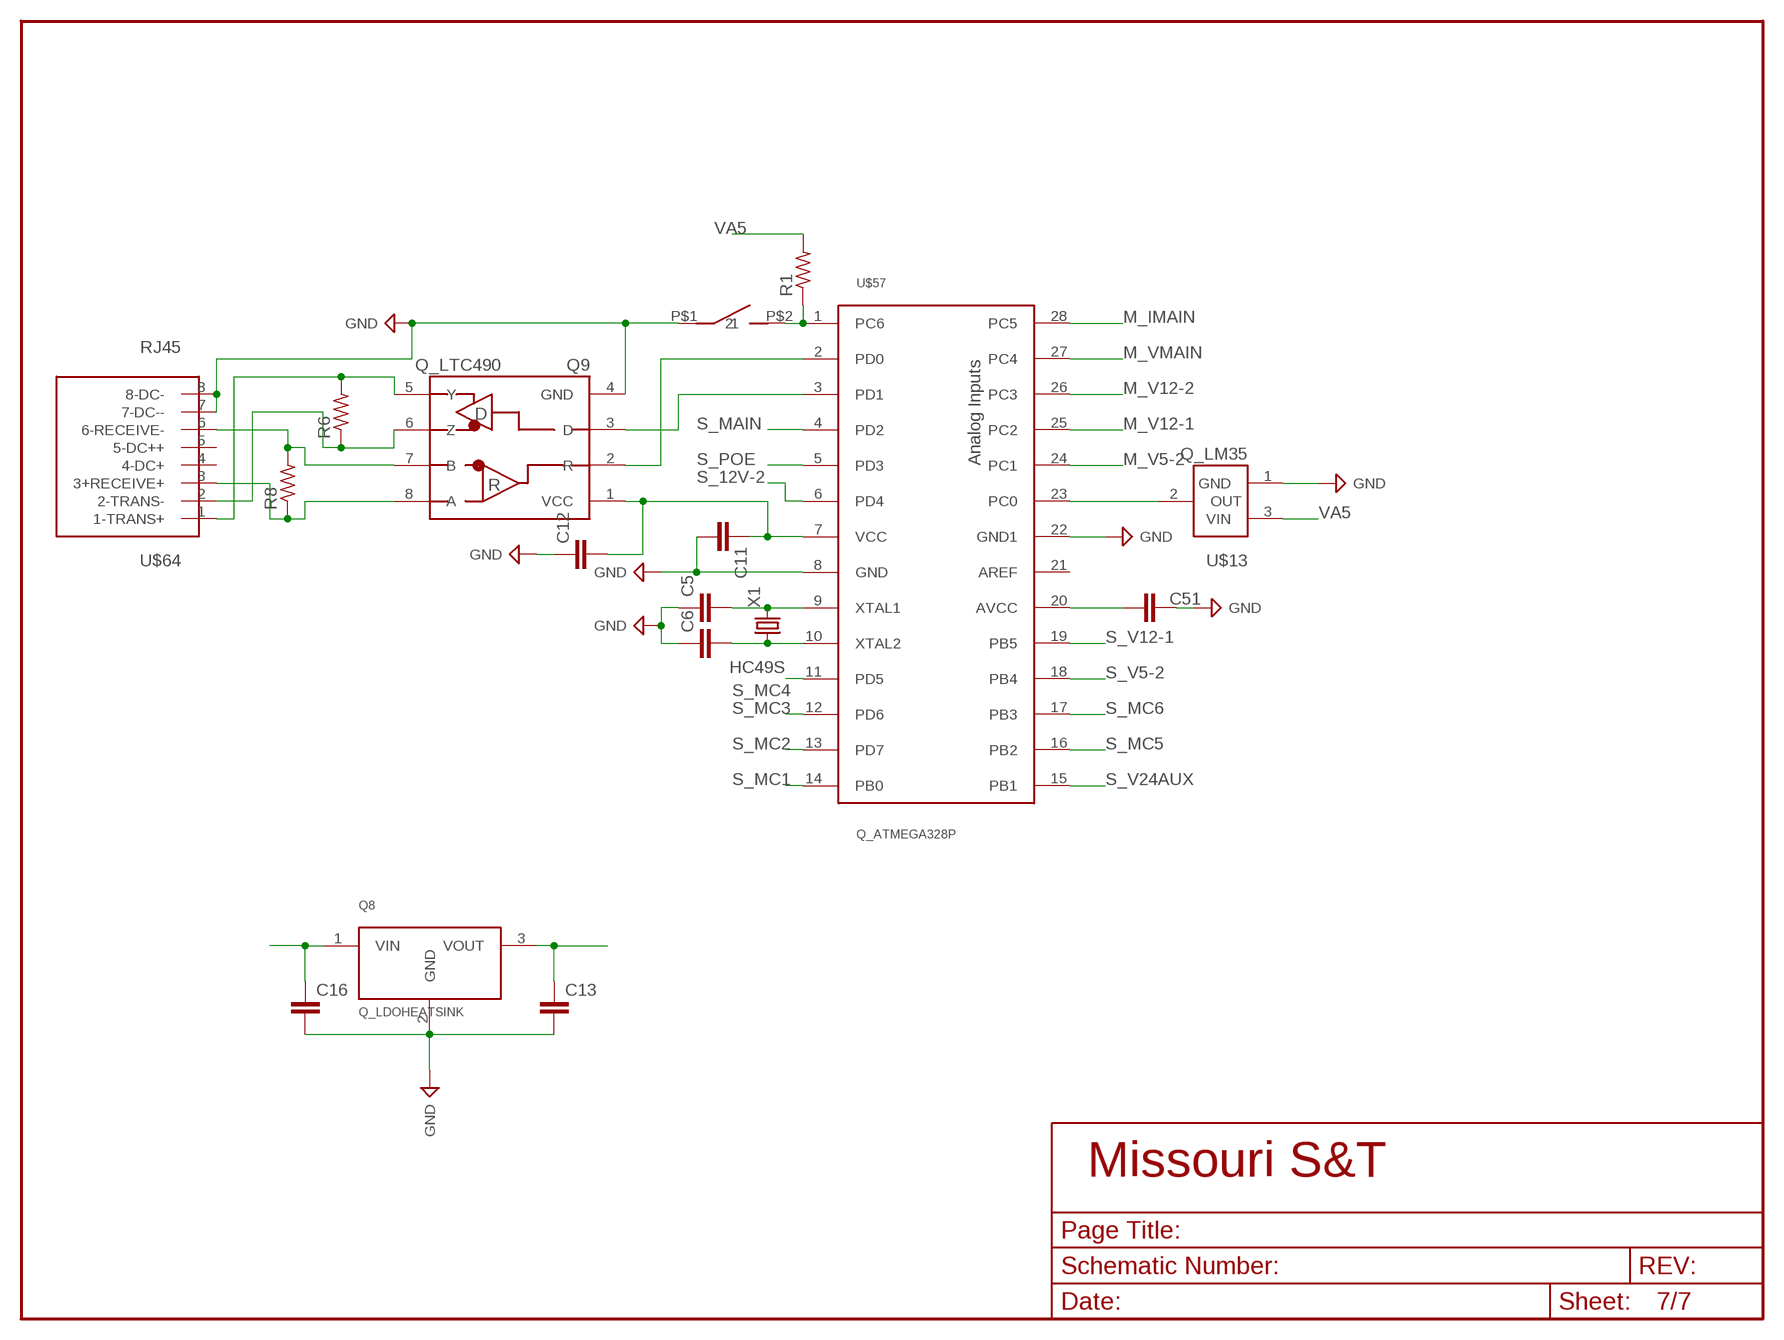
[diagram p6: schematic, sheet 7]

### Parts
C5  C_CAP_1206  [C_1206]
C6  C_CAP_1206  [C_1206]
C11  C_CAP_1206  [C_1206]
C12  C_CAP_1206  [C_1206]
C13  C_CAP_1206  [C_1206]
C16  C_CAP_1206  [C_1206]
C51  C_CAP_1206  [C_1206]
J1  J_MC32857  [J_TOGGLE]
Q8  Q_LDOHEATSINK  [TO220_6025DG]
Q9  Q_LTC490  [DIP8]
R1  R_RES_1206  [R_1206]
R6  R_RES_1206  [R_1206]
R8  R_RES_1206  [R_1206]
U$13  Q_LM35  [TO-92-3]
U$57  Q_ATMEGA328P  [DIP28]
U$64  RJ45  [RJ45-CAT5E]
X1  HC49S  X_HC49SCRYSTAL  [HC-49]

### Nets
GND: C5.1 C6.1 C11.2 C12.1 C13.2 C16.2 C51.1 J1.P$1 Q8.2(GND) Q9.4(GND) U$13.1(GND) U$57.8(GND) U$57.22(GND1) U$64.7(7-DC--) U$64.8(8-DC-) ; supply symbol labelled SUP_GND ; also sheet 1,2,3,4,5,6
M_IMAIN: U$57.28(PC5) ; also sheet 1
M_V5-2: U$57.24(PC1) ; also sheet 2
M_V12-1: U$57.25(PC2) ; also sheet 3
M_V12-2: U$57.26(PC3) ; also sheet 3
M_VMAIN: U$57.27(PC4) ; also sheet 1
N$6: U$13.2(OUT) U$57.23(PC0)
N$82: C5.2 U$57.9(XTAL1) X1.P$2
N$83: C6.2 U$57.10(XTAL2) X1.P$1
N$84: Q9.2(R) U$57.2(PD0)
N$86: J1.P$2 R1.1 U$57.1(PC6)
N$87: Q9.3(D) U$57.3(PD1)
N$89: Q9.5(Y) R6.2 U$64.1(1-TRANS+)
N$90: Q9.6(Z) R6.1 U$64.2(2-TRANS-)
N$91: Q9.7(B) R8.2 U$64.6(6-RECEIVE-)
N$93: Q9.8(A) R8.1 U$64.3(3+RECEIVE+)
S_12V-2: U$57.6(PD4) ; also sheet 3
S_MAIN: U$57.4(PD2) ; also sheet 1
S_MC1: U$57.14(PB0) ; also sheet 5
S_MC2: U$57.13(PD7) ; also sheet 5
S_MC3: U$57.12(PD6) ; also sheet 5
S_MC4: U$57.11(PD5) ; also sheet 5
S_MC5: U$57.16(PB2) ; also sheet 5
S_MC6: U$57.17(PB3) ; also sheet 5
S_POE: U$57.5(PD3) ; also sheet 3
S_V5-2: U$57.18(PB4) ; also sheet 2
S_V12-1: U$57.19(PB5) ; also sheet 3
S_V24AUX: U$57.15(PB1) ; also sheet 6
V1: C16.1 Q8.1(VIN) ; also sheet 1
VA5: C11.1 C12.2 C13.1 C51.2 Q8.3(VOUT) Q9.1(VCC) R1.2 U$13.3(VIN) U$57.7(VCC) U$57.20(AVCC)
Unconnected: U$57.21(AREF) U$64.4(4-DC+) U$64.5(5-DC++)

### Notes on the sheet
- Analog Inputs

## Library data of the parts
C1-C13 C16 C18-C21 C23-C25 C27-C55 C57 C68-C74 = Lib_Passive:C_CAP
C14 C15 C17 C22 C26 C56 C58-C67 = PCB0M1:C_POL: Alum Elect. Cap with 10mm diameter, 5mm lead spacing and 0.7mm lead diameter
D1-D10 = Lib_Katlyn:D_1.5KE480A: Zener Diode
H1-H4 = Lib_TH:H_MNTHOLE
J1 = PCB0M1:J_MC32857: SWITCH, TACTILE, SPST-NO, 50mA, THD
J2 = PCB0M1:J_0399700102: High Current Power Connector
J3-J8 U$14 U$26 U$31 U$36 U$40 U$44 U$52-U$55 U$72 = PCB0M1:J_1546074-2
JOLTEON-12V-1 MAGNEMITE-12V-2 PICKACHU-5V RAICHU-5V-CRIT ZAPDOS-20V = PCB0M1:Q_PTN78020: TI DC/DC converter 36Vin - Adjustable output
L1-L10 = PCB0M1:L_29F0429: Through-Hole Ferrite Bead 285 Ohm @ 100MHz
N1-N8 = PCB0M1:RJ45-2PORT: RJSAE-5080-02 RJ45 Connector 1 on 1 port
Q1 Q3-Q7 Q15 = Lib_Katlyn:U_FDPF045N10A: N-FET
Q2 = PCB0M1:Q_IRFB7437PBF_HS: 40V 195A N-CH MOSFET switch with heatsink
Q8 = PCB0M1:Q_LDO: LDO with fixed ouput voltage
Q9 = PCB0M1:Q_LTC490: IC, RS422-RS485 DRVR
Q10-Q12 Q14 = PCB0M1:Q_2N7000: Small N-Channel MOSFET Logic Level
R1 R6 R8-R11 R15 R16 R18 R20-R24 R28 R30-R32 = Lib_Passive:R_RES
R2-R5 R12 R25 = Lib_TH:R
R7 = PCB0M1:R_FC4L110R001JER
R13 R14 R17 R19 R26 R27 R29 = PCB0M1:R_1/4WL: Standard 1/4W resistor package that has long leads to bridge traces
U$11 U$17 U$23 U$27 U$32 U$37 U$41 U$70 = PCB0M1:Q_MIC5021: MIC5021 High Side Driver with Electronic Breaker
U$13 = PCB0M1:Q_LM35: IC, TEMPERATURE SENSOR, 0.4°C, TO-92-3
U$16 = PCB0M1:Q_ZXCT1109: Unipolar current sensor
U$45-U$50 U$73 = PCB0M1:R_2512
U$57 = PCB0M1:Q_ATMEGA328P: ATMEGA 328P in 28PIN PDIP package
U$64 = PCB0M1:RJ45
X1 = PCB0M1:X_HC49SCRYSTAL: CRYSTAL METAL CAN, 16MHZ, 18PF, HC-49/US

## Board
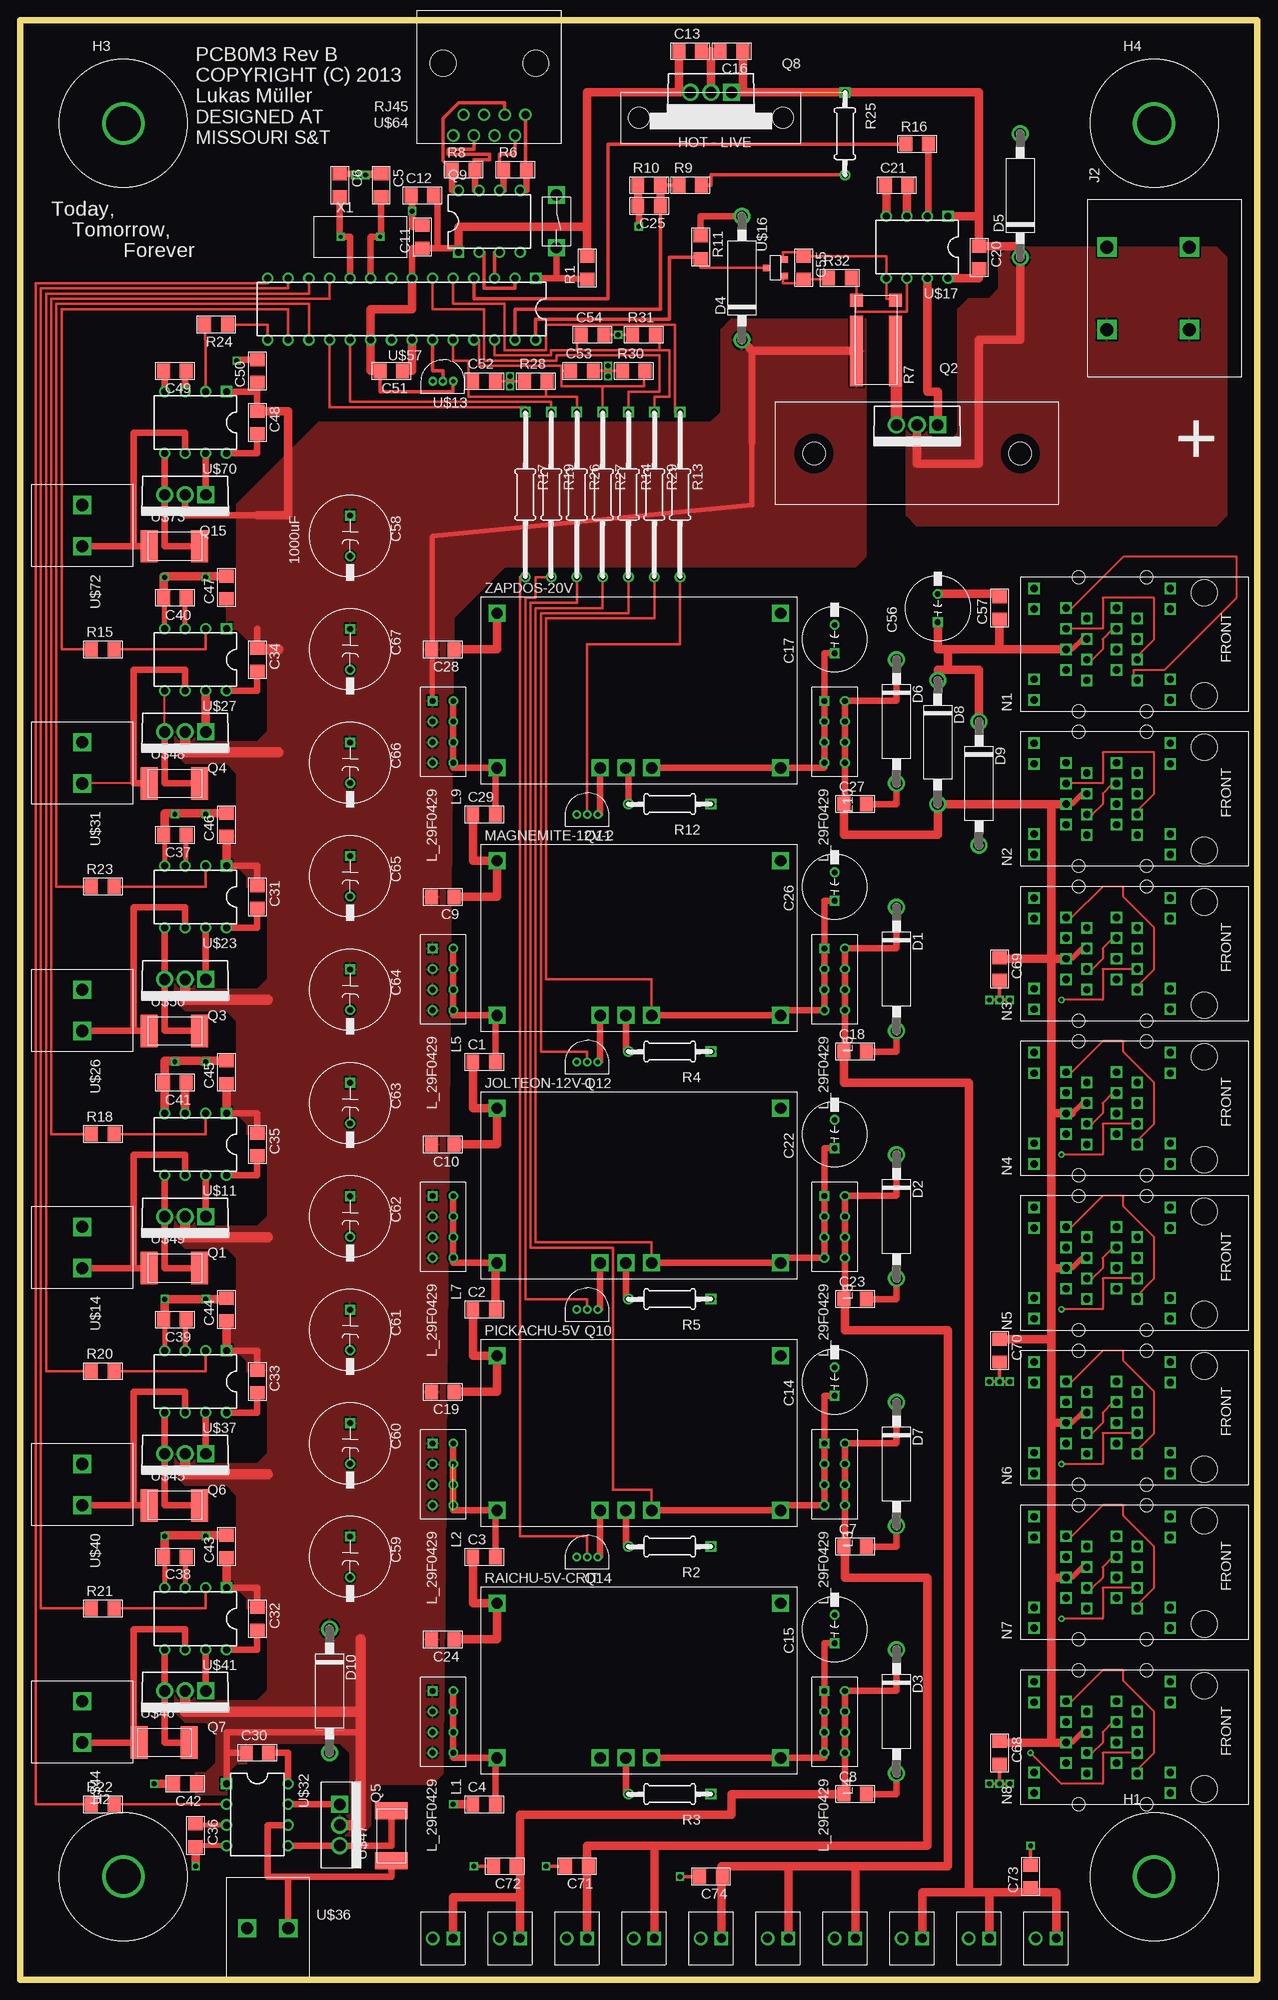
[diagram p7: board, top side]
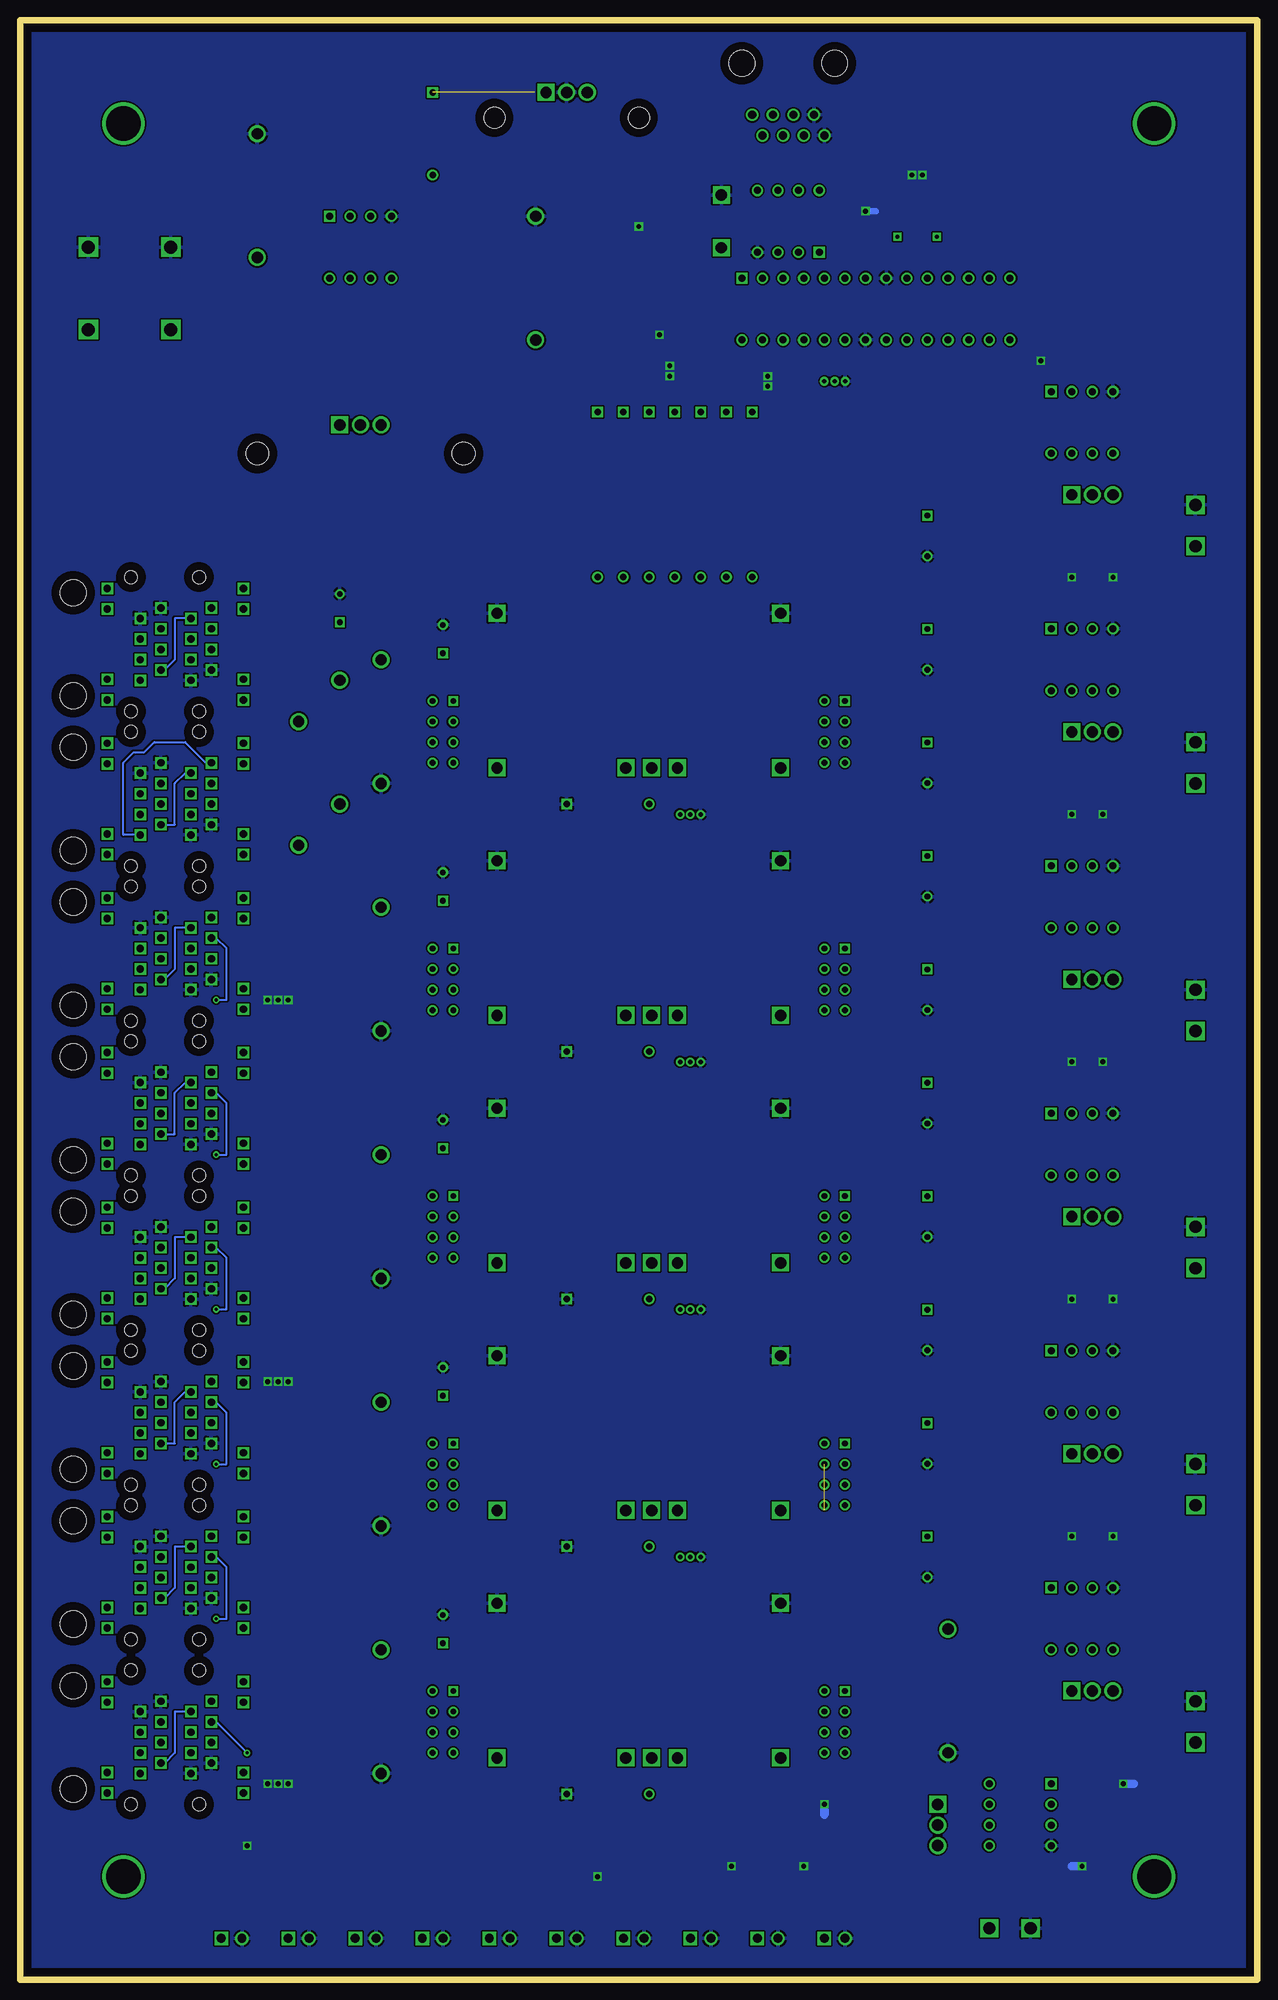
[diagram p8: board, bottom side, seen from below]

Size 152.4 x 241.3 mm. Coordinates in mm from the lower left corner, seen from the top.
Outline: 0,0 152.4,0 152.4,241.3 0,241.3 0,0
Copper layers (1*16): Top 0.035mm / dielectric 1.5mm / Bottom 0.035mm
Design rules: minimum track width 10mil, minimum drill 15mil, track to track 8mil, track to pad 8mil, pad to pad 8mil, via to via 8mil, smd to smd 8mil, copper to edge 40mil, drill to drill 8mil, minimum pad ring 10mil, minimum via ring 8mil, stop-mask expansion 4mil, vias tented up to drill 0mil, thermal gap 10mil

### Footprints (pad centres in the part's own frame; a part is rotated, then mirrored left to right if it is on the bottom)
C_1206 = smd 1.6 x 1.8: 1 -1.4,0; 2 1.4,0
C_8MM = drill 0.7 square: + -1.75,0 | drill 0.7: - 1.75,0
C_10MM = drill 0.7 square: P$1 -2.5,0 | drill 0.7: P$2 2.5,0
DIODE_D3.5MM_LS15.24MM = drill 1.397: A 7.62,0; C -7.62,0
H_MNTHOLE_#8 = drill 4.216: 1 0,0
J_TOGGLE = drill 1.4 square: P$1 -3.25,0; P$2 3.25,0
J_2CONHC = drill 1.6 square: PIN1-1 -5.08,-3.05; PIN1-2 -5.08,7.11; PIN2-1 5.08,-3.05; PIN2-2 5.08,7.11
J_2.54MM = drill 1.1 square: P$1 -1.27,0 | drill 1.1: P$2 1.27,0
R_PDSS-T7 = drill 1.4 square: 1 -17.47,9.53; 2 -17.47,-9.52; 3 -4.77,-9.52; 4 -1.59,-9.52; 5 1.59,-9.52; 6 17.47,-9.52; 7 17.47,9.53
L_29F0429 = drill 0.7 square: 1 -3.81,-1.27 | drill 0.7: 2 -1.27,-1.27; 3 1.27,-1.27; 4 3.81,-1.27; 5 3.81,1.27; 6 1.27,1.27; 7 -1.27,1.27; 8 -3.81,1.27
RJ45-CAT5E-2PACK = drill 0.9 square: 1-1 12.7,-5.664; 1-2 11.43,-8.204; 1-3 10.16,-5.664; 1-4 8.89,-8.204; 1-5 7.62,-5.664; 1-6 6.35,-8.204; 1-7 5.08,-5.664; 1-8 3.81,-8.204; 2-1 3.81,-14.427; 2-2 5.08,-11.887; 2-3 6.35,-14.427; 2-4 7.62,-11.887; 2-5 8.89,-14.427; 2-6 10.16,-11.887; 2-7 11.43,-14.427; 2-8 12.7,-11.887; P$1 1.397,-1.727; P$2 15.113,-1.727; P$3 1.397,-18.491; P$4 3.937,-18.491; P$5 15.113,-18.491; P$6 12.573,-18.491; P$7 3.937,-1.727; P$8 12.573,-1.727 | hole 3.251: 1.905,-22.682; 14.605,-22.682 | hole 1.6: 0,-15.57; 16.51,-15.57; 0,-7.188; 16.51,-7.188
TO220F = drill 1.397 square: 1 -2.54,0 | drill 1.397: 2 0,0; 3 2.54,0
TO-220-531102B02500G = drill 1.397 square: 1 -2.54,-3.507 | drill 1.397: 2 0,-3.507; 3 2.54,-3.507 | hole 2.8: -12.7,0; 12.7,0
TO220_6025DG = drill 1.397 square: 1 -2.54,0 | drill 1.397: 2 0,0; 3 2.54,0 | hole 2.6: -8.89,3.115; 8.89,3.115
DIP8 = drill 0.864 square: 1 -3.81,-3.81 | drill 0.864: 2 -1.27,-3.81; 3 1.27,-3.81; 4 3.81,-3.81; 5 3.81,3.81; 6 1.27,3.81; 7 -1.27,3.81; 8 -3.81,3.81
TO-92-3 = drill 0.55: 1 1.27,0; 2 0,0; 3 -1.27,0
R_1206 = smd 1.6 x 1.8: 1 -1.4,0; 2 1.4,0
R_1/4W = drill 0.813 square: 1 -5.08,0 | drill 0.813: 2 5.08,0
R_FC4L = smd 1.6 x 8.7: 1 2.4,-1.35; 2 -2.4,-1.35 | smd 1.6 x 1.6: SENSE1 2.4,4.9; SENSE2 -2.4,4.9
R_1/4WL = drill 0.8 square: 1 -10.16,0 | drill 0.8: 2 10.16,0
THERM_BLOCK_2 = drill 1.5 square: P$1 2.54,0; P$2 -2.54,0
SOT23 = smd 0.8 x 0.9: 1 -1,-1.1; 2 1,-1.1; 3 0,1.1
R_2512 = smd 2.1 x 4: P$1 -3.15,0; P$2 3.05,0
DIP28 = drill 0.864 square: 1 -16.51,-3.81 | drill 0.864: 2 -13.97,-3.81; 3 -11.43,-3.81; 4 -8.89,-3.81; 5 -6.35,-3.81; 6 -3.81,-3.81; 7 -1.27,-3.81; 8 1.27,-3.81; 9 3.81,-3.81; 10 6.35,-3.81; 11 8.89,-3.81; 12 11.43,-3.81; 13 13.97,-3.81; 14 16.51,-3.81; 15 16.51,3.81; 16 13.97,3.81; 17 11.43,3.81; 18 8.89,3.81; 19 6.35,3.81; 20 3.81,3.81; 21 1.27,3.81; 22 -1.27,3.81; 23 -3.81,3.81; 24 -6.35,3.81; 25 -8.89,3.81; 26 -11.43,3.81; 27 -13.97,3.81; 28 -16.51,3.81
RJ45-CAT5E = drill 1: 1 -4.445,4.655; 2 -3.175,7.195; 3 -1.905,4.655; 4 -0.635,7.195; 5 0.635,4.655; 6 1.905,7.195; 7 3.175,4.655; 8 4.445,7.195 | hole 3.2: 5.715,-1.695; -5.715,-1.695
HC-49 = drill 0.5 square: P$1 -2.44,0; P$2 2.44,0

### Placement (x,y rotation side)
C1  57.15,113.03 0 top
C2  57.15,82.55 0 top
C3  57.15,52.07 0 top
C4  57.15,21.59 0 top
C5  44.45,220.98 270 top
C6  39.37,220.98 270 top
C7  102.87,53.34 0 top
C8  102.87,22.86 0 top
C9  52.07,133.35 180 top
C10  52.07,102.87 180 top
C11  49.53,214.63 90 top
C12  49.53,219.71 0 top
C13  82.55,237.49 0 top
C14  100.33,73.66 90 top
C15  100.33,43.18 90 top
C16  87.63,237.49 180 top
C17  100.33,165.1 90 top
C18  102.87,114.3 0 top
C19  52.07,72.39 180 top
C20  118.11,212.09 270 top
C21  107.95,220.98 0 top
C22  100.33,104.14 90 top
C23  102.87,83.82 0 top
C24  52.07,41.91 180 top
C25  77.47,218.44 180 top
C26  100.33,134.62 90 top
C27  102.87,144.78 0 top
C28  52.07,163.83 180 top
C29  57.15,143.51 0 top
C30  29.21,27.94 0 top
C31  29.21,133.35 270 top
C32  29.21,44.45 270 top
C33  29.21,73.66 270 top
C34  29.21,162.56 270 top
C35  29.21,102.87 270 top
C36  21.59,17.78 270 top
C37  19.05,140.97 180 top
C38  19.05,52.07 180 top
C39  19.05,81.28 180 top
C40  19.05,170.18 180 top
C41  19.05,110.49 180 top
C42  20.32,24.13 180 top
C43  25.4,53.34 90 top
C44  25.4,82.55 90 top
C45  25.4,111.76 90 top
C46  25.4,142.24 90 top
C47  25.4,171.45 90 top
C48  29.21,191.77 270 top
C49  19.05,198.12 180 top
C50  29.21,198.12 90 top
C51  45.72,198.12 180 top
C52  57.15,196.85 0 top
C53  69.22,198.12 0 top
C54  70.48,202.56 0 top
C55  96.52,210.82 270 top
C56  113.03,168.91 90 top
C57  120.65,168.91 90 top
C58  40.64,177.8 270 top
C59  40.64,52.07 270 top
C60  40.64,66.04 270 top
C61  40.64,80.01 270 top
C62  40.64,93.98 270 top
C63  40.64,107.95 270 top
C64  40.64,121.92 270 top
C65  40.64,135.89 270 top
C66  40.64,149.86 270 top
C67  40.64,163.83 270 top
C68  120.65,27.94 270 top
C69  120.65,124.46 270 top
C70  120.65,77.47 270 top
C71  68.58,13.97 180 top
C72  59.69,13.97 180 top
C73  124.46,12.7 90 top
C74  85.09,12.7 180 top
D1  107.95,124.46 270 top
D2  107.95,93.98 270 top
D3  107.95,33.02 270 top
D4  88.9,209.55 90 top
D5  123.19,219.71 90 top
D6  107.95,154.94 270 top
D7  107.95,63.5 270 top
D8  113.03,152.4 270 top
D9  118.11,147.32 270 top
D10  38.1,35.56 270 top
H1  139.7,12.7 0 top
H2  12.7,12.7 0 top
H3  12.7,228.6 0 top
H4  139.7,228.6 0 top
J1  66.04,216.53 270 top
J2  140.97,208.28 90 top
J3  85.09,5.08 180 top
J4  93.34,5.08 180 top
J5  101.6,5.08 180 top
J6  109.86,5.08 180 top
J7  118.11,5.08 180 top
J8  126.36,5.08 180 top
JOLTEON-12V-1  76.2,97.79 0 top
L1  52.07,31.75 270 top
L2  52.07,62.23 270 top
L3  100.33,62.23 270 top
L4  100.33,31.75 270 top
L5  52.07,123.19 270 top
L6  100.33,123.19 270 top
L7  52.07,92.71 270 top
L8  100.33,92.71 270 top
L9  52.07,153.67 270 top
L10  100.33,153.67 270 top
MAGNEMITE-12V-2  76.2,128.27 0 top
N1  123.19,156.21 90 top
N2  123.19,137.16 90 top
N3  123.19,118.11 90 top
N4  123.19,99.06 90 top
N5  123.19,80.01 90 top
N6  123.19,60.96 90 top
N7  123.19,41.91 90 top
N8  123.19,21.59 90 top
PICKACHU-5V  76.2,67.31 0 top
Q1  20.32,93.98 180 top
Q2  110.49,187.96 180 top
Q3  20.32,123.19 180 top
Q4  20.32,153.67 180 top
Q5  39.37,19.05 270 top
Q6  20.32,64.77 180 top
Q7  20.32,35.56 180 top
Q8  85.09,232.41 180 top
Q9  57.78,216.53 0 top
Q10  69.85,82.55 180 top
Q11  69.85,143.51 180 top
Q12  69.85,113.03 180 top
Q14  69.85,52.07 180 top
Q15  20.32,182.88 180 top
R1  69.85,210.82 90 top
R2  80.01,53.34 180 top
R3  80.01,22.86 180 top
R4  80.01,114.3 180 top
R5  80.01,83.82 180 top
R6  60.96,222.88 0 top
R7  105.41,201.93 0 top
R8  54.61,222.88 0 top
R9  82.55,220.98 0 top
R10  77.47,220.98 0 top
R11  83.82,213.36 270 top
R12  80.01,144.78 180 top
R13  81.28,182.88 270 top
R14  74.93,182.88 270 top
R15  10.16,163.83 0 top
R16  110.49,226.06 0 top
R17  62.23,182.88 270 top
R18  10.16,104.14 0 top
R19  65.41,182.88 270 top
R20  10.16,74.93 0 top
R21  10.16,45.72 0 top
R22  10.16,21.59 0 top
R23  10.16,134.62 0 top
R24  24.13,203.84 180 top
R25  101.6,227.33 270 top
R26  68.58,182.88 270 top
R27  71.75,182.88 270 top
R28  63.5,196.85 0 top
R29  78.11,182.88 270 top
R30  75.56,198.12 0 top
R31  76.83,202.56 0 top
R32  100.97,209.55 0 top
RAICHU-5V-CRIT  76.2,36.83 0 top
U$11  21.59,102.87 180 top
U$13  52.07,196.85 180 top
U$14  7.62,90.17 270 top
U$16  93.03,210.82 90 top
U$17  110.49,213.36 180 top
U$23  21.59,133.35 180 top
U$26  7.62,119.38 270 top
U$27  21.59,162.56 180 top
U$31  7.62,149.86 270 top
U$32  29.21,20.32 270 top
U$36  30.48,6.35 0 top
U$37  21.59,73.66 180 top
U$40  7.62,60.96 270 top
U$41  21.59,44.45 180 top
U$44  7.62,31.75 270 top
U$45  19.05,58.42 0 top
U$46  17.78,29.21 0 top
U$47  45.72,17.78 90 top
U$48  19.05,147.32 0 top
U$49  19.05,87.63 0 top
U$50  19.05,116.84 0 top
U$52  52.07,5.08 180 top
U$53  60.33,5.08 180 top
U$54  68.58,5.08 180 top
U$55  76.83,5.08 180 top
U$57  46.99,205.74 180 top
U$64  57.78,234.31 180 top
U$70  21.59,191.77 180 top
U$72  7.62,179.07 270 top
U$73  19.05,176.53 0 top
X1  41.91,214.63 0 top
ZAPDOS-20V  76.2,158.75 0 top

### Tracks (layer width: path | path; a pad name or v marks a point on that pad's centre or on a via)
GND  (via drill 0.6)
  Top 0.305: C52.2 60.33,196.85 | 60.33,196.85 v60.33,197.49 | v60.33,196.22 60.33,196.85 | 60.33,196.85 R28.1 | 72.39,198.12 C53.2 | 72.39,198.12 v72.39,198.75 | v72.39,197.49 72.39,198.12 | 72.39,198.12 R30.1 | C54.2 v73.66,202.56 R31.1
  Top 0.406: C68.2 v120.65,24.13 | v120.65,24.13 v121.92,24.13 | v120.65,24.13 v119.38,24.13 | C69.2 v120.65,120.65 | v120.65,120.65 v119.38,120.65 | v120.65,120.65 v121.92,120.65 | C70.2 v120.65,73.66 | v120.65,73.66 v121.92,73.66 | v120.65,73.66 v119.38,73.66 | C73.2 v124.46,16.51 | C72.2 v55.88,13.97 | 67.31,13.97 C71.2 v64.77,13.97 | C74.2 v81.28,12.7
  Top 0.61: C37.2 17.78,140.97 U$23.4 | 17.78,81.28 U$37.4 | 17.78,52.07 U$41.4 | U$32.4 21.59,16.51 C36.2 | U$27.4 17.78,170.18 C40.2
  Top 0.813: 86.36,237.49 C16.2 85.09,237.49 C13.2 | 48.26,219.07 C12.1 48.26,219.71 48.26,219.07 | 48.26,219.07 v48.26,217.81 48.26,215.9 49.53,215.9 C11.2 | v41.27,222.25 41.27,222.38 C6.1 C5.1 42.55,222.38 v42.55,222.25 44.45,222.25 | C8.2 107.95,22.86 D3.A | C7.2 107.95,53.34 D7.A | C23.2 107.95,83.82 D2.A | C18.2 107.95,114.3 D1.A | C27.2 107.95,144.78 D6.A | C49.2 17.78,198.12 U$70.4 | D4.A 83.82,217.17 R11.1 | C25.2 76.2,218.44 v76.2,215.9 | C50.2 26.67,199.52 v26.67,199.39
  Top 1.016: U$17.4 106.68,220.98 C21.1 | R10.1 C25.2 | Q8.2 85.09,237.49 | C41.2 17.78,110.49 | 17.78,110.49 U$11.4 | C51.1 48.26,198.12 U$57.22 | C56.- 120.65,170.66 C57.2 | C42.2 v16.51,24.13 | C36.2 v21.59,13.97 | C4.1 v53.34,21.59 | C39.2 17.78,81.28 v17.78,83.82 v22.86,83.82 25.4,83.82 C44.2 | C43.2 17.78,54.74 v17.78,54.61 17.78,52.07 C38.2 | C45.2 17.78,113.16 17.78,110.49 | C46.2 17.78,143.64 17.78,140.97 | C9.1 58.73,133.35 MAGNEMITE-12V-2.1 55.75,137.8 C29.1 | C28.1 58.73,163.83 ZAPDOS-20V.1 | C10.1 58.73,102.87 JOLTEON-12V-1.1 55.75,107.32 C1.1 | C19.1 58.73,72.39 PICKACHU-5V.1 55.75,76.84 C2.1 | C24.1 58.73,41.91 RAICHU-5V-CRIT.1 55.75,46.36 C3.1 | C47.2 17.65,172.85 C40.2
  Bottom 0.813: v48.26,217.81 46.99,217.81
  Bottom 1.016: v16.51,24.13 15.24,24.13 | v21.59,13.97 22.86,13.97 | v53.34,21.59 53.34,20.32
  other vias: 22.86,54.61 19.05,113.03 22.86,113.03 19.05,143.51 22.86,143.51 17.78,172.72 22.86,172.72
  pour Bottom: 2.54,0 152.4,0 152.4,238.76 149.86,241.3 0,241.3 0,2.54
M_IMAIN
  Top 0.305: U$16.3 83.82,210.82 R11.2
  Top 0.406: U$57.28 63.5,204.47 80.01,204.47 80.01,212.09 83.19,212.09 R11.2
M_V5-2
  Top 0.305: U$57.24 53.34,199.39 55.24,199.39 55.24,197.49 | 64.77,194.94 55.24,194.94 55.24,197.49 | 64.77,194.94 68.58,194.94 R26.1 | C52.1 55.24,197.49 | R28.2 64.77,197.49 64.77,194.94
M_V12-1
  Top 0.305: U$57.25 56.52,201.93 56.52,198.75 66.67,198.75 66.67,198.12 | 66.67,198.12 66.67,196.22 71.75,196.22 | 71.75,196.22 R27.1 | C53.1 66.67,198.12 | R30.2 76.83,198.12 76.83,196.22 71.75,196.22
M_V12-2
  Top 0.305: R31.2 78.74,202.56 78.74,200.66 | 78.74,200.66 68.58,200.66 | 68.58,200.66 65.41,200.66 65.41,200.03 58.42,200.03 U$57.26 | 78.74,200.66 80.01,200.66 80.01,194.94 78.11,194.94 R29.1 | 69.22,202.56 C54.1 68.58,202.56 68.58,200.66
M_VMAIN
  Top 0.406: R10.2 R9.1 | U$57.27 60.96,205.74 78.87,205.74 C25.1
  Top 1.016: C25.1 R10.2
N$1
  Top 0.813: R4.2 74.61,114.3 MAGNEMITE-12V-2.4
N$2
  Top 0.305: R29.2 78.11,167.64 64.77,167.64 64.77,123.19 77.79,123.19 MAGNEMITE-12V-2.5
  Top 0.813: MAGNEMITE-12V-2.5 MAGNEMITE-12V-2.6 93.98,118.75 93.98,119.38 L6.4 L6.3 L6.2 L6.1 99.06,132.87 C26.+
N$3
  Top 0.305: Q14.2 69.85,54.61 61.59,54.61 61.59,172.72 R17.2
N$4
  Top 0.813: R5.2 74.61,83.82 JOLTEON-12V-1.4
N$5
  Top 0.305: R27.2 71.75,168.91 63.5,168.91 63.5,90.81 77.79,90.81 JOLTEON-12V-1.5
  Top 0.813: JOLTEON-12V-1.5 JOLTEON-12V-1.6 93.67,88.9 L8.4 L8.3 L8.2 L8.1 99.06,102.39 C22.+
N$6
  Top 0.406: U$57.23 50.8,198.12 52.07,198.12 U$13.2
N$7
  Top 0.254: N6.1-1 129.54,73.66 133.35,77.47 135.89,77.47 135.89,76.2 139.7,72.39 139.7,67.31 137.16,64.77 N6.2-1
N$8
  Bottom 0.254: N6.2-2 133.35,66.04 133.35,71.12 132.08,72.39 N6.1-2
N$9  (via drill 0.38)
  Top 0.254: v128.27,63.5 133.35,63.5 133.35,67.31 N6.2-3
  Bottom 0.254: v128.27,63.5 127,63.5 127,69.85 128.27,71.12 N6.1-3
N$10
  Top 0.254: N6.1-6 132.08,67.31 133.35,68.58 133.35,69.85 134.62,71.12 N6.2-6
N$11
  Top 0.254: N5.1-1 129.54,92.71 133.35,96.52 135.89,96.52 135.89,95.25 139.7,91.44 139.7,86.36 137.16,83.82 N5.2-1
N$12
  Bottom 0.254: N5.1-2 133.35,91.44 133.35,86.36 134.62,85.09 N5.2-2
N$13  (via drill 0.38)
  Top 0.254: v128.27,82.55 133.35,82.55 133.35,86.36 N5.2-3
  Bottom 0.254: v128.27,82.55 127,82.55 127,88.9 128.27,90.17 N5.1-3
N$14
  Top 0.254: N5.1-6 132.08,86.36 133.35,87.63 133.35,88.9 134.62,90.17 N5.2-6
N$15
  Top 0.254: N4.1-1 129.54,111.76 133.35,115.57 135.89,115.57 135.89,114.3 139.7,110.49 139.7,105.41 137.16,102.87 N4.2-1
N$16
  Bottom 0.254: N4.2-2 133.35,104.14 133.35,109.22 132.08,110.49 N4.1-2
N$17  (via drill 0.38)
  Top 0.254: v128.27,101.6 133.35,101.6 133.35,105.41 N4.2-3
  Bottom 0.254: v128.27,101.6 127,101.6 127,107.95 128.27,109.22 N4.1-3
N$18
  Top 0.254: N4.1-6 132.08,105.41 133.35,106.68 133.35,107.95 134.62,109.22 N4.2-6
N$19
  Top 0.254: N3.1-1 129.54,130.81 133.35,134.62 135.89,134.62 135.89,133.35 139.7,129.54 139.7,124.46 137.16,121.92 N3.2-1
N$20
  Bottom 0.254: N3.1-2 133.35,129.54 133.35,124.46 134.62,123.19 N3.2-2
N$21
  Top 0.254: N3.1-6 132.08,124.46 133.35,125.73 133.35,127 134.62,128.27 N3.2-6
N$22
  Bottom 0.254: N2.1-1 129.54,149.86 132.08,152.4 135.89,152.4 137.16,151.13 138.43,151.13 139.7,149.86 139.7,140.97 N2.2-1 137.16,140.97
N$23
  Bottom 0.254: N2.2-2 133.35,142.24 133.35,147.32 132.08,148.59 N2.1-2
N$24
  Top 0.254: N2.1-3 133.35,147.32 133.35,151.13 139.7,151.13 139.7,146.05 137.16,143.51 N2.2-3
N$25
  Top 0.254: N2.1-6 132.08,143.51 133.35,144.78 133.35,146.05 134.62,147.32 N2.2-6
N$26
  Top 0.254: N1.1-1 129.54,168.91 135.89,175.26 149.86,175.26 149.86,170.18 140.97,161.29 137.16,161.29 137.16,160.02 N1.2-1
N$27
  Bottom 0.254: N1.1-2 133.35,167.64 133.35,162.56 134.62,161.29 N1.2-2
N$28
  Top 0.254: N1.1-3 133.35,166.37 133.35,170.18 139.7,170.18 139.7,165.1 137.16,162.56 N1.2-3
N$29
  Top 0.254: N1.1-6 132.08,162.56 133.35,163.83 133.35,165.1 134.62,166.37 N1.2-6
N$30  (via drill 0.38)
  Top 0.254: v128.27,120.65 133.35,120.65 133.35,124.46 N3.2-3
  Bottom 0.254: v128.27,120.65 127,120.65 127,127 128.27,128.27 N3.1-3
N$31
  Top 0.254: N7.1-1 129.54,54.61 133.35,58.42 135.89,58.42 135.89,57.15 139.7,53.34 139.7,48.26 137.16,45.72 N7.2-1
N$32
  Bottom 0.254: N7.1-2 133.35,53.34 133.35,48.26 134.62,46.99 N7.2-2
N$33  (via drill 0.38)
  Top 0.254: v128.27,44.45 133.35,44.45 133.35,48.26 N7.2-3
  Bottom 0.254: v128.27,44.45 127,44.45 127,50.8 128.27,52.07 N7.1-3
N$34
  Top 0.254: N7.1-6 132.08,48.26 133.35,49.53 133.35,50.8 134.62,52.07 N7.2-6
N$35
  Top 0.254: N8.1-1 129.54,34.29 133.35,38.1 135.89,38.1 135.89,36.83 139.7,33.02 139.7,27.94 137.16,25.4 N8.2-1
N$36
  Bottom 0.254: N8.1-2 133.35,33.02 133.35,27.94 134.62,26.67 N8.2-2
N$37  (via drill 0.38)
  Top 0.254: v124.46,27.94 128.27,24.13 133.35,24.13 133.35,27.94 N8.2-3
  Bottom 0.254: v124.46,27.94 128.27,31.75 N8.1-3
N$38
  Top 0.254: N8.1-6 132.08,27.94 133.35,29.21 133.35,30.48 134.62,31.75 N8.2-6
N$39
  Top 0.813: U$49.P$2 17.78,87.63 Q1.3 U$11.5
N$40
  Top 0.813: U$49.P$1 13.97,87.63 | 13.97,87.63 13.97,101.6 20.32,101.6 U$11.6 | U$14.P$1 13.97,87.63
N$41
  Top 0.813: Q1.1 U$11.7
N$42
  Top 0.305: R18.2 22.86,104.14 U$11.2
N$43
  Top 0.813: U$11.8 29.21,99.06 C35.2
N$44
  Top 1.016: U$17.7 111.76,195.58 113.03,195.58 Q2.1
N$45
  Top 1.422: Q2.3 107.95,200.58 R7.1
N$46
  Top 0.305: R7.SENSE1 107.81,207.01 106.68,207.01 U$17.5 106.68,212.22 C55.1 96.52,212.72 93.98,212.72 93.98,211.82 U$16.2
N$47
  Top 0.813: U$17.2 111.89,217.17 R16.2
N$48
  Top 1.016: U$17.3 109.22,220.98 C21.2
N$49
  Top 0.813: R3.2 74.61,22.86 RAICHU-5V-CRIT.4
N$50
  Top 0.813: R2.2 74.61,53.34 PICKACHU-5V.4
N$51
  Top 0.305: R32.1 99.56,209.42 C55.2 96.52,208.91 93.98,208.91 93.98,209.82 U$16.1
N$52
  Top 0.813: U$23.5 Q3.3 17.78,116.84 U$50.P$2
N$53
  Top 0.305: R26.2 68.58,169.54 62.87,169.54 62.87,90.17 73.03,90.17 73.03,60.33 77.79,60.33 PICKACHU-5V.5
  Top 0.813: 93.98,58.42 93.67,58.42 PICKACHU-5V.6 | PICKACHU-5V.5 93.98,57.79 93.98,58.42 | 93.98,58.42 L3.4 L3.3 L3.2 L3.1 99.06,71.91 C14.+
N$54
  Top 0.813: RAICHU-5V-CRIT.5 RAICHU-5V-CRIT.6 94.31,27.3 99.06,27.3 L4.4 L4.3 L4.2 L4.1 99.06,41.43 C15.+
N$55
  Top 0.254: 15.24,116.84 U$26.P$1
  Top 0.813: U$50.P$1 15.24,116.84 | U$23.6 20.32,132.08 13.97,132.08 13.97,116.84 U$50.P$1 | U$26.P$1 U$50.P$1
N$56
  Top 0.813: U$23.7 Q3.1
N$57
  Top 0.813: L5.8 L5.7 L5.6 L5.5 53.34,118.75 MAGNEMITE-12V-2.2 58.55,118.75 C1.2
N$58
  Top 0.305: R23.2 22.86,134.62 U$23.2
N$59
  Top 0.813: U$23.8 29.21,129.54 C31.2
N$60
  Top 0.254: Q4.3 U$27.5
  Top 0.813: U$48.P$2 17.78,147.32 Q4.3
N$61
  Top 0.254: 13.97,147.32 U$31.P$1
  Top 0.813: U$48.P$1 13.97,147.32 13.97,161.29 20.32,161.29 U$27.6
N$62
  Top 1.016: U$27.7 Q4.1
N$63
  Top 0.305: R15.2 22.86,163.83 U$27.2
N$64
  Top 0.813: U$27.8 29.21,158.75 C34.2
N$65  (3 unrouted)
  Top 0.813: L2.8 53.34,57.79 PICKACHU-5V.2 58.55,57.79 C3.2
N$66
  Top 0.813: U$47.P$2 45.72,16.51 Q5.3 U$32.5
N$67
  Top 0.813: U$47.P$1 45.72,12.7 33.02,12.7 | 33.02,12.7 30.48,12.7 30.48,19.05 U$32.6 | U$36.P$1 33.02,12.7
N$68
  Top 0.813: Q5.1 U$32.7
N$69
  Top 0.305: R22.2 U$32.2
N$70
  Top 0.813: U$32.8 33.02,27.94 C30.2
N$71
  Top 0.813: U$37.5 Q6.3 17.78,58.42 U$45.P$2
N$72
  Top 0.813: 13.97,58.42 U$45.P$1 15.24,58.42 | 13.97,58.42 U$40.P$1 | 13.97,58.42 13.97,72.39 20.32,72.39 U$37.6
N$73
  Top 0.813: Q6.1 U$37.7
N$74
  Top 0.305: R20.2 22.86,74.93 U$37.2
N$75
  Top 0.813: U$37.8 29.21,69.85 C33.2 29.21,72.39
N$76
  Top 0.813: U$46.P$2 17.78,29.21 Q7.3 U$41.5
N$77
  Top 0.813: 13.97,29.21 13.97,43.18 20.32,43.18 U$41.6 | U$44.P$1 13.97,29.21 | 13.97,29.21 U$46.P$1
N$78
  Top 0.813: U$41.7 Q7.1
N$79
  Top 0.305: R21.2 22.86,45.72 U$41.2
N$80
  Top 0.813: U$41.8 29.21,40.64 C32.2
N$81
  Top 0.813: U$70.5 Q15.3 17.78,176.53 U$73.P$2
N$82
  Top 0.813: U$57.9 43.18,214.63 X1.P$2 44.45,214.63 C5.2
N$83
  Top 0.813: U$57.10 40.64,214.63 X1.P$1 39.37,214.63 C6.2
N$84
  Top 0.406: Q9.2 57.15,212.72 57.15,208.28 60.96,208.28 U$57.2
N$85
  Top 0.305: U$17.6 109.22,205.42 102.87,205.42 102.87,206.83 R7.SENSE2 103.01,209.55 R32.2
N$86
  Top 0.813: U$57.1 66.04,209.55 | J1.P$2 66.04,209.55 | R1.1 67.31,209.55 66.04,209.55
N$87
  Top 0.406: Q9.3 58.42,212.72 U$57.3
N$88
  Top 0.61: ZAPDOS-20V.4 74.93,149.23
  Top 0.813: 74.93,149.23 R12.2
N$89
  Top 0.406: 62.23,222.88 U$64.1
  Top 0.813: Q9.5 62.36,220.34 R6.2 62.23,222.88
N$90
  Top 0.406: 59.69,222.88 R6.1 59.05,222.88 59.05,224.79 60.96,224.79 U$64.2
  Top 0.813: Q9.6 59.56,220.34 R6.1
N$91
  Top 0.406: 55.88,222.88 55.88,224.16 57.78,224.16 57.78,224.79 52.7,224.79 52.7,225.43 55.88,225.43 U$64.6
  Top 0.813: 55.88,222.88 R8.2 56.01,220.34 Q9.7
N$92
  Top 0.406: R9.2 85.09,220.98 85.09,222.25 R25.2
N$93
  Top 0.406: U$64.3 59.69,231.14 53.98,231.14 52.07,229.24 52.07,224.03 R8.1
  Top 0.813: Q9.8 53.21,220.34 R8.1
N$94
  Top 0.813: U$73.P$1 13.97,176.53 | 13.97,176.53 13.97,190.5 20.32,190.5 U$70.6 | U$72.P$1 13.97,176.53
N$95
  Top 1.016: C20.2 118.11,209.55 U$17.8
N$97
  Top 0.813: ZAPDOS-20V.5 ZAPDOS-20V.6 99.06,149.23 L10.4 L10.3 L10.2 L10.1 99.06,163.35 C17.+
N$98
  Top 0.813: L9.8 L9.7 L9.6 L9.5 53.34,149.23 ZAPDOS-20V.2 58.55,149.23 C29.2
N$99
  Top 0.813: JOLTEON-12V-1.3 71.43,82.55 Q10.3
N$100
  Top 0.813: MAGNEMITE-12V-2.3 71.43,113.03 Q12.3
N$101
  Top 0.813: ZAPDOS-20V.3 71.43,143.51 Q11.3
N$103
  Top 0.813: PICKACHU-5V.3 71.43,52.07 Q14.3
N$104
  Top 1.016: C41.1 20.32,110.49 U$11.3
N$105
  Top 0.61: U$23.3 20.45,137.16 C37.1
N$106
  Top 0.61: U$32.3 21.59,19.05 C36.1
N$107
  Top 0.61: C38.1 20.32,52.07 U$41.3
N$108
  Top 0.61: C39.1 20.32,81.28 U$37.3
N$109
  Top 0.61: U$27.3 20.32,170.18 C40.1
N$110
  Top 0.813: JOLTEON-12V-1.2 53.34,88.27 L7.5 L7.6 L7.7 L7.8
  Top 1.016: JOLTEON-12V-1.2 58.55,88.27 C2.2
N$111
  Top 0.305: Q11.2 69.85,164.47 81.28,164.47 R13.2
N$112
  Top 0.813: L1.8 L1.7 L1.6 L1.5 53.34,27.31 RAICHU-5V-CRIT.2 58.55,27.31 C4.2
N$113
  Top 0.305: Q10.2 69.85,83.82 62.23,83.82 62.23,170.18 63.5,170.18 63.5,172.72 R19.2
N$114
  Top 0.305: Q12.2 69.85,114.3 64.14,114.3 64.14,168.28 74.93,168.28 R14.2
N$115
  Top 0.813: Q15.1 U$70.7
N$116
  Top 0.813: U$70.8 29.21,187.96 C48.2
N$117
  Top 0.813: C49.1 20.32,198.12 U$70.3
N$118
  Top 0.305: R24.2 22.86,201.29 U$70.2
S_12V-2
  Top 0.305: U$57.6 50.8,205.74 57.15,205.74 57.15,199.39 66.04,199.39 66.04,200.03 78.74,200.03 78.74,195.58 74.93,195.58 R14.1
S_MAIN
  Top 0.406: U$57.4 55.88,207.01 72.39,207.01 72.39,226.06 R16.1
S_MC1
  Top 0.305: R22.1 1.91,21.59 1.91,208.91 30.48,208.91 U$57.14
S_MC2
  Top 0.305: R21.1 2.54,45.72 2.54,208.28 33.02,208.28 U$57.13
S_MC3
  Top 0.305: R20.1 3.17,74.93 3.17,207.65 35.56,207.65 U$57.12
S_MC4
  Top 0.305: R18.1 3.81,104.14 3.81,207.01 38.1,207.01 U$57.11
S_MC5
  Top 0.305: R15.1 5.08,163.83 5.08,205.74 33.02,205.74 U$57.16
S_MC6
  Top 0.305: R23.1 4.45,134.62 4.45,206.38 35.56,206.38 U$57.17
S_POE
  Top 0.305: U$57.5 53.34,206.38 59.69,206.38 59.69,200.66 64.77,200.66 64.77,203.84 80.64,203.84 80.64,193.04 R13.1
S_V5-2
  Top 0.305: U$57.18 38.1,193.68 62.23,193.68 R17.1
S_V12-1
  Top 0.305: U$57.19 40.64,194.31 65.41,194.31 R19.1
S_V24AUX
  Top 0.305: R24.1 30.48,203.84 U$57.15
V1  (1 unrouted)
  Top 0.813: 88.9,237.49 C16.1
  Top 1.016: U$17.1 118.11,217.17 | 118.11,217.17 C20.1 123.19,213.49 D5.C 123.19,201.93 118.11,201.93 118.11,186.69 110.49,186.69 Q2.2 | 89.03,232.41 C16.1 | Q8.1 89.03,232.41 | 89.03,232.41 118.11,232.41 118.11,217.17
  pour Top: 109.22,180.34 109.22,191.77 111.76,191.77 111.76,190.5 113.03,189.23 114.3,189.23 115.57,190.5 115.57,205.74 116.84,207.01 119.38,207.01 120.65,208.28 120.65,212.09 121.92,213.36 147.32,213.36 148.59,212.09 148.59,180.34 147.32,179.07 110.49,179.07
V5-CRT
  Top 0.406: C72.1 61.59,13.97 61.59,12.7
  Top 0.813: C8.1 101.6,22.86 L4.5 L4.6 L4.7 L4.8 107.95,35.56 D3.C
  Top 1.016: U$52.P$1 53.34,10.16 61.59,10.16 | 61.59,10.16 U$53.P$1 | C8.1 87.63,22.86 87.63,20.32 61.59,20.32 61.59,12.7 61.59,10.16
V12
  Top 0.406: C71.1 69.85,13.97 69.85,15.24
  Top 0.813: C7.1 101.6,53.34 L3.5 L3.6 L3.7 L3.8 107.95,66.04 D7.C
  Top 1.016: 78.11,16.51 69.85,16.51 69.85,15.24 U$54.P$1 | U$55.P$1 78.11,16.51 | 78.11,16.51 111.76,16.51 111.76,49.53 101.6,49.53 101.6,53.34
V15_1
  Top 0.406: C73.1 124.46,10.79
  Top 0.813: C18.1 101.6,114.3 L6.5 L6.6 L6.7 L6.8 107.95,127 D1.C
  Top 1.016: J6.P$1 111.12,10.79 116.84,10.79 | J8.P$1 127.64,10.79 124.46,10.79 119.38,10.79 | 116.84,10.79 116.84,110.49 101.47,110.49 C18.1 | J7.P$1 119.38,10.79 | 119.38,10.79 116.84,10.79
V15_2
  Top 0.406: C74.1 86.36,12.7 86.36,11.43
  Top 0.813: C23.1 101.6,83.82 L8.5 L8.6 L8.7 L8.8 107.95,96.52 D2.C
  Top 1.016: J3.P$1 86.36,11.43 86.36,13.97 94.61,13.97 | 94.61,13.97 J4.P$1 | 101.6,83.82 101.6,80.01 114.3,80.01 114.3,13.97 102.87,13.97 | 102.87,13.97 94.61,13.97 | J5.P$1 102.87,13.97
V24
  Top 0.61: L9.1 50.8,177.8 90.17,181.61 90.17,189.23
  Top 0.813: U$11.1 29.21,106.68 C35.1 | U$41.1 29.21,48.26 C32.1 | U$23.1 29.21,137.16 C31.1 | U$32.1 25.4,27.94 | 25.4,27.94 25.4,30.48 41.91,30.48 | 90.17,200.58 90.17,189.23 | C30.1 25.4,27.94 | U$37.1 29.21,77.47 C33.1 | 29.21,166.37 C34.1 29.21,163.83 | C24.2 50.8,41.91 | C48.1 C50.1 29.21,195.58 U$70.1 | Q15.2 20.32,180.34 29.21,180.34
  Top 1.016: D4.C 90.17,200.58 R7.2 | C46.1 U$23.1 | C45.1 U$11.1 | C44.1 U$37.1 | C43.1 U$41.1 | C48.1 33.02,193.17 33.02,180.34 29.21,180.34
  Top 1.27: Q5.2 41.91,19.05 41.91,30.48 41.91,33.02 | Q7.2 20.32,33.02 41.91,33.02 | Q6.2 20.32,62.23 30.48,62.23 | Q1.2 20.32,91.44 30.48,91.44 | Q3.2 20.32,120.65 30.48,120.65 | Q4.2 20.32,151.13 31.75,151.13 | 41.91,33.02 41.91,41.91 | 29.21,163.83 31.75,163.83
  pour Top: 104.14,204.47 104.14,175.26 102.87,173.99 59.69,173.99 53.34,167.64 52.07,31.75 36.83,31.75 36.83,191.77 85.09,191.77 86.36,193.04 86.36,203.2 87.63,204.47
  pour Top: 36.83,191.77 26.67,181.61 26.67,170.18 25.4,170.18 25.4,166.37 26.67,166.37 29.21,163.83 36.83,163.83
  pour Top: 30.48,163.83 30.48,153.67 29.21,152.4 21.59,152.4 21.59,153.67 19.05,153.67 19.05,151.13 20.32,149.86 25.4,149.86 26.67,148.59 26.67,140.97 25.4,140.97 25.4,137.16 26.67,137.16 27.94,135.89 27.94,134.62 30.48,134.62 30.48,123.19 29.21,121.92 21.59,121.92 21.59,123.19 19.05,123.19 19.05,120.65 20.32,119.38 25.4,119.38 26.67,118.11 26.67,110.49 25.4,110.49 25.4,106.68 26.67,106.68 27.94,105.41 27.94,104.14 30.48,104.14 30.48,93.98 29.21,92.71 21.59,92.71 21.59,93.98 19.05,93.98 19.05,91.44 20.32,90.17 25.4,90.17 26.67,88.9 26.67,81.28 25.4,81.28 25.4,77.47 26.67,77.47 27.94,76.2 27.94,74.93 30.48,74.93 30.48,64.77 29.21,63.5 21.59,63.5 21.59,64.77 19.05,64.77 19.05,62.23 20.32,60.96 25.4,60.96 26.67,59.69 26.67,52.07 25.4,52.07 25.4,48.26 26.67,48.26 27.94,46.99 27.94,45.72 30.48,45.72 30.48,35.56 29.21,34.29 21.59,34.29 21.59,35.56 19.05,35.56 19.05,33.02 20.32,31.75 22.86,31.75 24.13,30.48 24.13,26.67 22.86,25.4 21.59,25.4 21.59,22.86 25.4,22.86 25.4,25.4 26.67,26.67 27.94,26.67 27.94,29.21 39.37,29.21 40.64,27.94 40.64,20.32 39.37,20.32 39.37,17.78 41.91,17.78 43.18,19.05 43.18,22.86 44.45,24.13 50.8,24.13 52.07,25.4 52.07,163.83
V_ANTENNA
  Top 0.61: N1.1-5 129.54,163.83 130.81,165.1 N1.1-4
  Top 1.016: 114.3,161.29 113.03,161.29 D8.C | 114.3,161.29 114.3,163.83 | 114.3,163.83 120.65,163.83 | 120.65,163.83 N1.1-5 | 114.3,163.83 113.03,163.83 C56.+ | 114.3,161.29 118.11,161.29 D9.C | C57.1 120.65,163.83
V_POE
  Top 0.406: 120.65,29.21 C68.1 | C69.1 120.65,125.73
  Top 0.61: N8.1-5 129.54,29.21 130.81,30.48 N8.1-4 | N7.1-5 129.54,49.53 130.81,50.8 N7.1-4 | N6.1-5 129.54,68.58 130.81,69.85 N6.1-4 | N5.1-5 129.54,87.63 130.81,88.9 N5.1-4 | N4.1-5 129.54,106.68 130.81,107.95 N4.1-4 | N3.1-5 129.54,125.73 130.81,127 N3.1-4 | N2.1-5 129.54,144.78 130.81,146.05 N2.1-4
  Top 0.813: C27.1 101.6,144.78 L10.5 L10.6 L10.7 L10.8 107.95,157.48 D6.C
  Top 1.016: 127,29.21 120.65,29.21 | 127,29.21 127,49.53 | 127,49.53 127,68.58 | 127,68.58 127,78.87 | 127,78.87 127,87.63 | 127,87.63 127,106.68 | 127,106.68 127,125.73 | 127,125.73 127,144.78 | 127,144.78 D8.A 113.03,140.97 101.47,140.97 C27.1 | N7.1-5 127,49.53 | 127,29.21 N8.1-5 | N6.1-5 127,68.58 | N5.1-5 127,87.63 | N2.1-5 127,144.78 | N3.1-5 127,125.73 | 129.54,106.68 127,106.68 | 120.65,125.73 127,125.73 | C70.1 127,78.87
VA5
  Top 0.406: U$13.3 53.34,195.58 44.32,195.58 C51.2
  Top 0.813: U$57.7 48.26,213.23 C11.1 51.44,213.23 | 51.44,213.23 53.98,213.23 Q9.1 | C12.2 51.44,220.34 51.44,213.23
  Top 1.016: Q8.3 81.15,232.41 | 81.15,232.41 C13.1 | 50.8,219.71 C12.2 | 69.85,212.09 R1.2 69.85,215.9 | 69.85,215.9 53.98,215.9 53.98,213.23 | U$57.7 48.26,205.74 43.18,205.74 U$57.20 43.18,198.12 C51.2 | 81.15,232.41 69.85,232.41 69.85,215.9

### Text on the board
tPlace: PCB0M3 Rev B | COPYRIGHT (C) 2013 | Lukas Müller | DESIGNED AT | MISSOURI S&T | Today, | Tomorrow, | Forever | +